# EasyEDA Pro project GroupProject2026.eprj

# Schematic Schematic1
Board Name: Board1; Create Date: 2026-05-30; Page Name: P1; Project Name: GroupProject2026; Schematic Name: Schematic1; Update Date: 2026-06-01; Company: EasyEDA.com; Page Size: A4; Version: V1.0
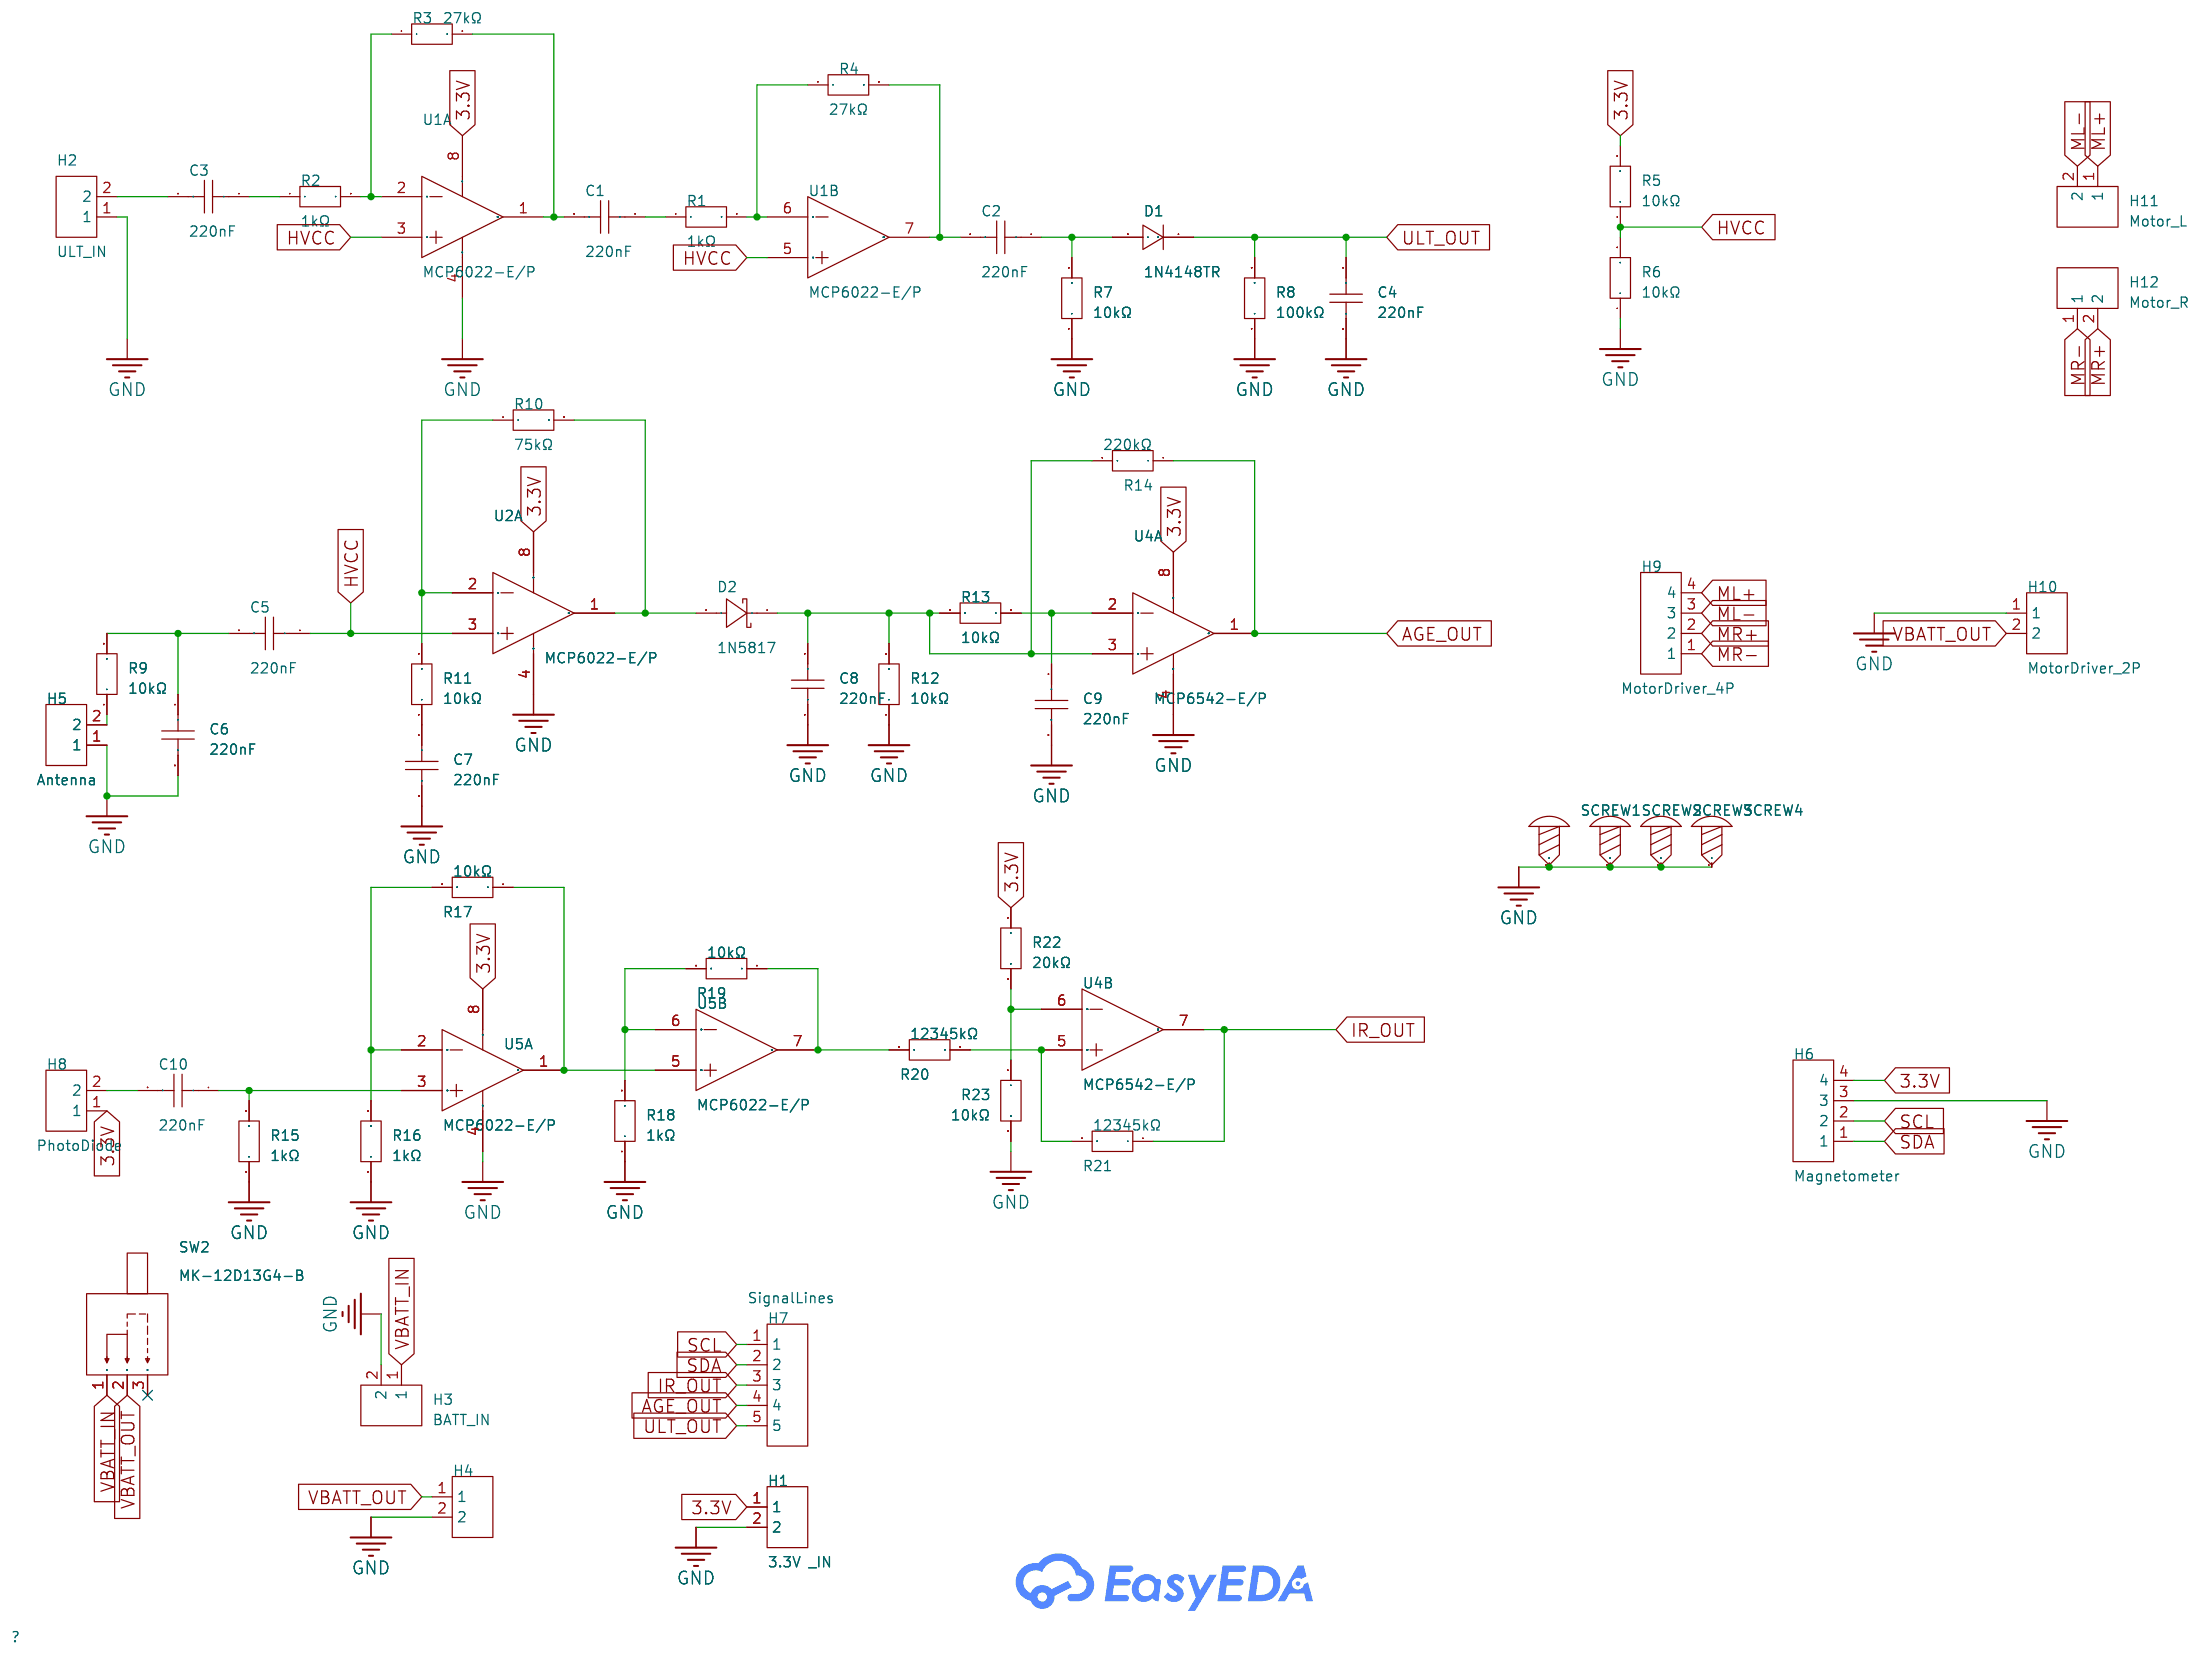
[diagram p0: schematic sheet]

## Parts
C1  220nF  [CAP-TH_L4.0-W2.5-P2.50-D0.5]
C2  220nF  [CAP-TH_L4.0-W2.5-P2.50-D0.5]
C3  220nF  [CAP-TH_L4.0-W2.5-P2.50-D0.5]
C4  220nF  [CAP-TH_L4.0-W2.5-P2.50-D0.5]
C5  220nF  [CAP-TH_L4.0-W2.5-P2.50-D0.5]
C6  220nF  [CAP-TH_L4.0-W2.5-P2.50-D0.5]
C7  220nF  [CAP-TH_L4.0-W2.5-P2.50-D0.5]
C8  220nF  [CAP-TH_L4.0-W2.5-P2.50-D0.5]
C9  220nF  [CAP-TH_L4.0-W2.5-P2.50-D0.5]
C10  220nF  [CAP-TH_L4.0-W2.5-P2.50-D0.5]
D1  1N4148TR  [DO-35_BD2.0-L4.2-P8.20-D0.5-RD]
D2  1N5817  [DO-41_BD2.4-L4.7-P8.70-D0.8-RD]
H1  3.3V _IN  [HDR-TH_2P-P2.54-V-M]
H2  ULT_IN  [HDR-TH_2P-P2.54-V-M]
H3  BATT_IN  [HDR-TH_2P-P2.54-V-M]
H4  BATT_OUT  [HDR-TH_2P-P2.54-V-M]
H5  Antenna  [HDR-TH_2P-P2.54-V-M]
H6  Magnetometer  [HDR-TH_4P-P2.54-V-M]
H7  SignalLines  [HDR-TH_5P-P2.54-V-M]
H8  PhotoDiode  [HDR-TH_2P-P2.54-V-M]
H9  MotorDriver_4P  [HDR-TH_4P-P2.54-V-M]
H10  MotorDriver_2P  [HDR-TH_2P-P2.54-V-M]
H11  Motor_L  [HDR-TH_2P-P2.54-V-M]
H12  Motor_R  [HDR-TH_2P-P2.54-V-M]
R1  1kΩ  [RES-TH_BD2.3-L6.3-P10.30-D0.6]
R2  1kΩ  [RES-TH_BD2.3-L6.3-P10.30-D0.6]
R3  27kΩ  [RES-TH_BD2.3-L6.3-P10.30-D0.6]
R4  27kΩ  [RES-TH_BD2.3-L6.3-P10.30-D0.6]
R5  10kΩ  [RES-TH_BD2.3-L6.3-P10.30-D0.6]
R6  10kΩ  [RES-TH_BD2.3-L6.3-P10.30-D0.6]
R7  10kΩ  [RES-TH_BD2.3-L6.3-P10.30-D0.6]
R8  100kΩ  [RES-TH_BD2.3-L6.3-P10.30-D0.6]
R9  10kΩ  [RES-TH_BD2.3-L6.3-P10.30-D0.6]
R10  75kΩ  [RES-TH_BD2.3-L6.3-P10.30-D0.6]
R11  10kΩ  [RES-TH_BD2.3-L6.3-P10.30-D0.6]
R12  10kΩ  [RES-TH_BD2.3-L6.3-P10.30-D0.6]
R13  10kΩ  [RES-TH_BD2.3-L6.3-P10.30-D0.6]
R14  220kΩ  [RES-TH_BD2.3-L6.3-P10.30-D0.6]
R15  1kΩ  [RES-TH_BD2.3-L6.3-P10.30-D0.6]
R16  1kΩ  [RES-TH_BD2.3-L6.3-P10.30-D0.6]
R17  10kΩ  [RES-TH_BD2.3-L6.3-P10.30-D0.6]
R18  1kΩ  [RES-TH_BD2.3-L6.3-P10.30-D0.6]
R19  10kΩ  [RES-TH_BD2.3-L6.3-P10.30-D0.6]
R20  12345kΩ  [RES-TH_BD2.3-L6.3-P10.30-D0.6]
R21  12345kΩ  [RES-TH_BD2.3-L6.3-P10.30-D0.6]
R22  20kΩ  [RES-TH_BD2.3-L6.3-P10.30-D0.6]
R23  10kΩ  [RES-TH_BD2.3-L6.3-P10.30-D0.6]
SCREW1  -  [Screw-Hole-M3]
SCREW2  -  [Screw-Hole-M3]
SCREW3  -  [Screw-Hole-M3]
SCREW4  -  [Screw-Hole-M3]
SW2  MK-12D13G4-B  [SW-TH_MK-12D13G4-B]
U1  MCP6022-E/P  [PDIP-8_L9.6-W6.4-P2.54-LS7.9-BL]  (sections 1,2)
U2  MCP6022-E/P  [PDIP-8_L9.6-W6.4-P2.54-LS7.9-BL]  (section 1)
U4  MCP6542-E/P  [PDIP-8_L9.3-W6.4-P2.54-LS7.9-BL-1]  (sections 1,2)
U5  MCP6022-E/P  [PDIP-8_L9.6-W6.4-P2.54-LS7.9-BL]  (sections 1,2)

## Library data of the parts
C1-C10 = RHEL81H224K1A2H03B: Capacitance:220nF Tolerance:±10% Tolerance:±10% Voltage Rating:50V Temperature Coefficient:X8L; LCSC Part Name: 220nF ±10% 50V; Supplier Part: C21327280; Manufacturer: muRata(村田); Supplier Footprint: 插件,P=2.5mm; Datasheet: https://item.szlcsc.com/datasheet/RHEL81H224K1A2H03B/22747908.html; Supplier: LCSC; Tolerance: ±10%; Voltage Rating: 50V; Temperature Coefficient: X8L
D1 = 1N4148TR_C84410: LCSC Part Name: 100V 200mA; Supplier Part: C84410; Manufacturer: onsemi(安森美); Supplier Footprint: DO-35; JLCPCB Part Class: Extended Part; Datasheet: https://item.szlcsc.com/datasheet/1N4148TR/85580.html; Supplier: LCSC; Diode Configuration: 1 Independent; Pd - Power Dissipation: 500mW; Current - Rectified: 200mA; Voltage - DC Reverse(Vr): 100V; Voltage - Forward(Vf@If): 1V@10mA; Non-Repetitive Peak Forward Surge Current: 4A; Reverse Leakage Current (Ir): 5uA@75V; Reverse Recovery Time (trr): 4ns; Operating Junction Temperature Range: -55℃~+175℃@(Tj)
D2 = 1N5817_C7544876: LCSC Part Name: 电压:20V 电流:1A; Supplier Part: C7544876; Manufacturer: LGE(鲁光); Supplier Footprint: DO-41; JLCPCB Part Class: Extended Part; Datasheet: https://item.szlcsc.com/datasheet/1N5817/8654312.html; Supplier: LCSC; Diode Configuration: Independent; Voltage - Forward(Vf@If): 450mV@1A; Voltage - DC Reverse(Vr): 20V; Current - Rectified: 1A; Reverse Leakage Current (Ir): 1mA@20V; Operating Junction Temperature Range: -65℃~+125℃; Non-Repetitive Peak Forward Surge Current: 30A
H1-H5 H8 H10-H12 = PZ254V-11-02P: LCSC Part Name: 1x2P 间距:2.54mm 方针 直插; Supplier Part: C492401; Manufacturer: XFCN(兴飞); Supplier Footprint: 插件,P=2.54mm; JLCPCB Part Class: Extended Part; Datasheet: https://item.szlcsc.com/datasheet/PZ254V-11-02P/502957.html; Supplier: LCSC; Pin Structure: 1x2P; Pitch: 2.54mm; Circluar Pins/Square Pins: Pin Header; Mounting Type: Through Hole; Number of Rows: 1; Number of Pins: 2P; Current Rating: 3A; Voltage Rating (Max): 250V; Length of Mating Pin: 6mm; Insulation Height: 2.5mm; Length of End Connection Pin: 3mm; Contact Material: Brass; Operating Temperature: -40℃~+105℃; Color: Black
H6 H9 = PZ2.54-S04P-A60: LCSC Part Name: 1x4P 间距:2.54mm 方针 直插; Supplier Part: C42431795; Manufacturer: JXTCONN(聚兴泰); Supplier Footprint: 插件,P=2.54mm; JLCPCB Part Class: Extended Part; Datasheet: https://item.szlcsc.com/datasheet/PZ2.54-S04P-A60/44458925.html; Supplier: LCSC; Pin Structure: 1x4P; Pitch: 2.54mm; Circluar Pins/Square Pins: Pin Header; Mounting Type: Through Hole; Number of Rows: 1; Number of Pins: 4P; Current Rating: 3A; Length of Mating Pin: 6mm; Insulation Height: 2.5mm; Length of End Connection Pin: 3mm; Contact Material: Brass; Contact Plating: Gold; Operating Temperature: -40℃~+105℃; Color: Black
H7 = 22284050: LCSC Part Name: 针座; Supplier Part: C563741; Manufacturer: MOLEX; Supplier Footprint: 插件; JLCPCB Part Class: Extended Part; Datasheet: https://www.molex.com/content/dam/molex/molex-dot-com/products/automated/en-us/salesdrawingpdf/423/42375/022284050_sd.pdf?inline\; Supplier: LCSC
R1-R23 = YR1B10KCC: LCSC Part Name: 金属膜电阻 10kΩ ±0.1% 250mW; Supplier Part: C1364313; Manufacturer: TE Connectivity(泰科电子); Supplier Footprint: 插件; JLCPCB Part Class: Extended Part; Datasheet: https://item.szlcsc.com/datasheet/YR1B10KCC/1454601.html; Supplier: LCSC; Type: Metal Film Resistor; Tolerance: ±0.1%; Power(Watts): 250mW; Temperature Coefficient: ±15ppm/℃; Operating Temperature: -65℃~+155℃
SCREW1-SCREW4 = Screw-Hole-M3: Supplier Footprint: 插件
SW2 = MK-12D13G4-B: LCSC Part Name: mini拨动开关; Supplier Part: C20611678; Manufacturer: HOOYA(皓宇电子); Supplier Footprint: 插件,P=2.5mm; JLCPCB Part Class: Extended Part; Datasheet: https://item.szlcsc.com/datasheet/MK-12D13G4-B/21966525.html; Supplier: LCSC; Circuit: SPDT; Actuator Style: Rectangular Columnar; Termination Style: PC Pin; Length: 8.5mm; Width: 3.5mm; Mounting Type: Right Angle; Current Rating: 300mA; Voltage Rating: 12V; Life: 10,000 Cycles
U1 U2 U5 = MCP6022-E/P: LCSC Part Name: 轨到轨输入/输出，10 MHz运算放大器; Supplier Part: C640398; Manufacturer: MICROCHIP(美国微芯); Supplier Footprint: PDIP-8; JLCPCB Part Class: Extended Part; Datasheet: https://item.szlcsc.com/datasheet/MCP6022-E%252FP/670195.html; Supplier: LCSC; Number of Channels: 2; Maximum Power Supply Range (Vdd-Vss): 7V; Rail to Rail: Rail-to-Rail Input, Rail-to-Rail Output; Gain Bandwidth Product: 10MHz; Vos - Input Offset Voltage: 500uV; Input Offset Voltage Drift(Vos TC): 3.5uV/℃; Slew Rate: 7V/us; Ib - Input Bias Current: 1pA; Input Offset Current(Ios): 1pA; Input Voltage Noise Density: 8.7nV/√Hz@10kHz; Common Mode Rejection Ratio(CMRR): 90dB; Quiescent Current: 1mA; Output Current: 30mA; Operating Temperature: -40℃~+125℃; Single supply: 2.5V~5.5V; Dual Supply: -8V~-1.25V；1.25V~8V; Features: Built-in compensation
U4 = MCP6542-E/P: Supplier Part: C640439; Manufacturer: MICROCHIP(美国微芯); Supplier Footprint: PDIP-8; JLCPCB Part Class: Extended Part; Datasheet: https://atta.szlcsc.com/upload/public/pdf/source/20200408/C511284_B645E46D72B56524CB56AE76B2D417C7.pdf; Supplier: LCSC; Input Offset Voltage (Vos): 7mV; Input Bias Current (Ib): 1pA; Input Hysteresis Voltage (Vhys): 6.5mV; Common Mode Rejection Ratio (CMRR): 70dB; Supply Voltage: 1.6V~5.5V; Output Type: 推挽; Output Mode: TTL；CMOS; Operating Temperature: -40℃~+125℃

## Nets
3.3V: H1.1 H6.4 H8.1 R5.2 R22.1 U1.8(VDD) U2.8(VDD) U4.8(VDD) U5.8(VDD)
GND: C4.2 C6.2 C7.2 C8.2 C9.2 H1.2 H2.1 H3.2 H4.2 H5.1 H6.3 H10.1 R6.1 R7.1 R8.1 R12.1 R15.1 R16.1 R18.1 R23.2 SCREW1.1 SCREW2.1 SCREW3.1 SCREW4.1 U1.4(VSS) U2.4(VSS) U4.4(VSS) U5.4(VSS)
VBATT_IN: H3.1 SW2.1
VBATT_OUT: H4.1 H10.2 SW2.2
AGE_OUT: H7.4 R14.1 U4.1(OUTA)
HVCC: C5.1 R5.1 R6.2 U1.3(VINA+) U1.5(VINB+) U2.3(VINA+)
IR_OUT: H7.3 R21.1 U4.7(OUTB)
ML+: H9.4 H11.1
ML-: H9.3 H11.2
MR+: H9.2 H12.2
MR-: H9.1 H12.1
SCL: H6.2 H7.1
SDA: H6.1 H7.2
ULT_OUT: C4.1 D1.1(C) H7.5 R8.2
$1N1242: C3.2 H2.2
$1N1247: C3.1 R2.1
$1N1252: R2.2 R3.1 U1.2(VINA–)
$1N1268: C1.2 R3.2 U1.1(VOUTA)
$1N1297: C1.1 R1.1
$1N1302: R1.2 R4.1 U1.6(VINB–)
$1N1324: C2.2 R4.2 U1.7(VOUTB)
$1N1575: C2.1 D1.2(A) R7.2
$1N2153: H5.2 R9.1
$1N2157: C5.2 C6.1 R9.2
$1N2539: C7.1 R11.1
$1N2543: R10.1 R11.2 U2.2(VINA–)
$1N2549: D2.2(A) R10.2 U2.1(VOUTA)
$1N2826: C8.1 D2.1(K) R12.2 R13.2 R14.2 U4.3(VINA+)
$1N2888: C9.1 R13.1 U4.2(VINA-)
$1N5513: C10.2 H8.2
$1N5517: C10.1 R15.2 U5.3(VINA+)
$1N5985: R16.2 R17.2 U5.2(VINA–)
$1N5989: R17.1 U5.1(VOUTA) U5.5(VINB+)
$1N6212: R19.1 R20.2 U5.7(VOUTB)
$1N6215: R18.2 R19.2 U5.6(VINB–)
$1N6281: R20.1 R21.2 U4.5(VINB+)
$1N6448: R22.2 R23.1 U4.6(VINB-)

Not connected (* = marked no-connect by the designer): SW2 3*

# Schematic Schematic2
Board Name: Board2; Create Date: 2026-06-01; Page Name: P1; Project Name: GroupProject2026; Schematic Name: Schematic2; Update Date: 2026-06-03; Company: EasyEDA.com; Page Size: A4; Version: V1.0
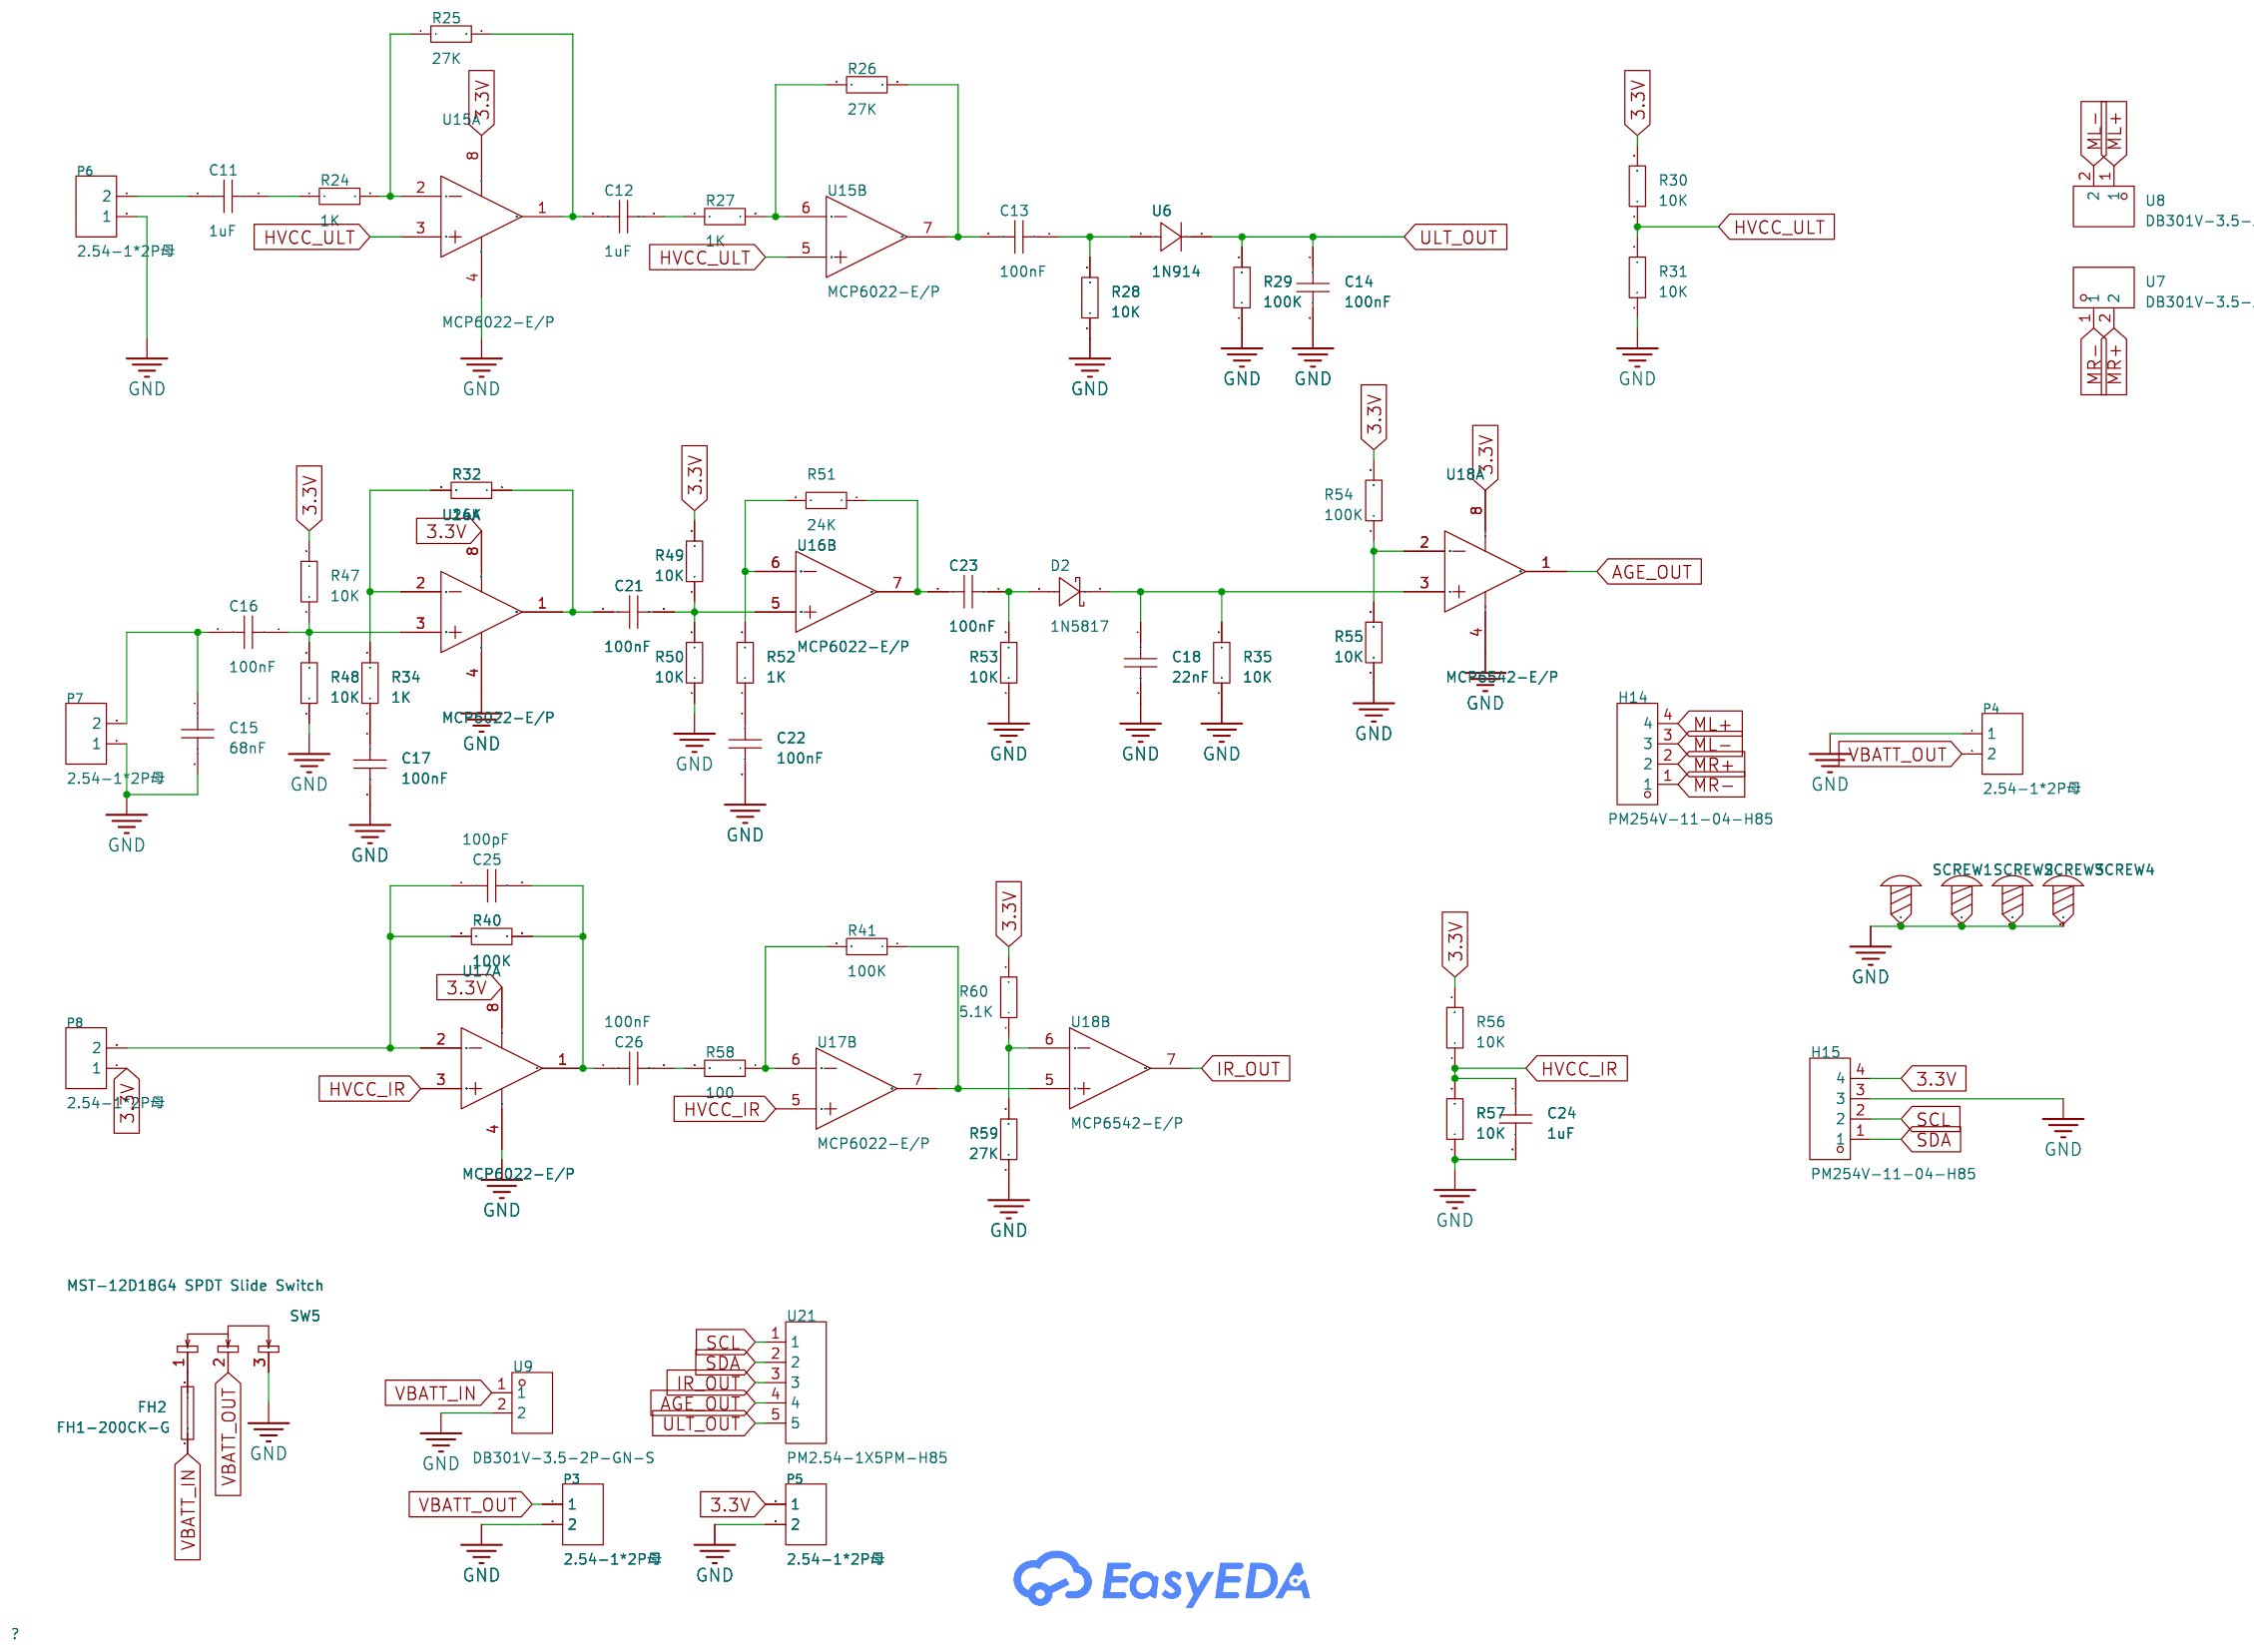
[diagram p1: schematic sheet]

## Parts
C11  1uF  [C0201]
C12  1uF  [C0201]
C13  100nF  [C0201]
C14  100nF  [C0201]
C15  68nF  [C0201]
C16  100nF  [C0201]
C17  100nF  [C0201]
C18  22nF  [C0201]
C21  100nF  [C0201]
C22  100nF  [C0201]
C23  100nF  [C0201]
C24  1uF  [C0201]
C25  100pF  [C0201]
C26  100nF  [C0201]
D2  1N5817  [DO-41_BD2.4-L4.7-P8.70-D0.8-RD]
FH2  FH1-200CK-G  [FUSE-TH_L24.8-W9.8-P22.60]
H14  PM254V-11-04-H85  [HDR-TH_4P-P2.54-V-F]
H15  PM254V-11-04-H85  [HDR-TH_4P-P2.54-V-F]
P3  2.54-1*2P母  [HDR-TH_2P-P2.54-V-F]
P4  2.54-1*2P母  [HDR-TH_2P-P2.54-V-F]
P5  2.54-1*2P母  [HDR-TH_2P-P2.54-V-F]
P6  2.54-1*2P母  [HDR-TH_2P-P2.54-V-F]
P7  2.54-1*2P母  [HDR-TH_2P-P2.54-V-F]
P8  2.54-1*2P母  [HDR-TH_2P-P2.54-V-F]
R24  1K  [R0603]
R25  27K  [R0603]
R26  27K  [R0603]
R27  1K  [R0603]
R28  10K  [R0603]
R29  100K  [R0603]
R30  10K  [R0603]
R31  10K  [R0603]
R32  24K  [R0603]
R34  1K  [R0603]
R35  10K  [R0603]
R40  100K  [R0603]
R41  100K  [R0603]
R47  10K  [R0603]
R48  10K  [R0603]
R49  10K  [R0603]
R50  10K  [R0603]
R51  24K  [R0603]
R52  1K  [R0603]
R53  10K  [R0603]
R54  100K  [R0603]
R55  10K  [R0603]
R56  10K  [R0603]
R57  10K  [R0603]
R58  100  [R0603]
R59  27K  [R0603]
R60  5.1K  [R0603]
SCREW1  -  [Screw-Hole-M3]
SCREW2  -  [Screw-Hole-M3]
SCREW3  -  [Screw-Hole-M3]
SCREW4  -  [Screw-Hole-M3]
SW5  MST-12D18G4 SPDT Slide Switch  [SW-SMD_MST-12D18G4-SPDT-SLIDE-SWITCH]
U6  1N914  [DO-35_BD2.0-L4.2-P8.20-D0.5-R-RD]
U7  DB301V-3.5-2P-GN-S  [CONN-TH_DB301V-3.5-2P-GN]
U8  DB301V-3.5-2P-GN-S  [CONN-TH_DB301V-3.5-2P-GN]
U9  DB301V-3.5-2P-GN-S  [CONN-TH_DB301V-3.5-2P-GN]
U15  MCP6022-E/P  [PDIP-8_L9.6-W6.4-P2.54-LS7.9-BL]  (sections 1,2)
U16  MCP6022-E/P  [PDIP-8_L9.6-W6.4-P2.54-LS7.9-BL]  (sections 1,2)
U17  MCP6022-E/P  [PDIP-8_L9.6-W6.4-P2.54-LS7.9-BL]  (sections 1,2)
U18  MCP6542-E/P  [PDIP-8_L9.3-W6.4-P2.54-LS7.9-BL-1]  (sections 1,2)
U21  PM2.54-1X5PM-H85  [HDR-TH_5P-P2.54-V-F-3]

## Library data of the parts
C11-C18 C21-C26 = CAP_0201: Supplier Footprint: 0201
D2 = 1N5817_C7544876: LCSC Part Name: 电压:20V 电流:1A; Supplier Part: C7544876; Manufacturer: LGE(鲁光); Supplier Footprint: DO-41; JLCPCB Part Class: Extended Part; Datasheet: https://item.szlcsc.com/datasheet/1N5817/8654312.html; Supplier: LCSC; Diode Configuration: Independent; Voltage - Forward(Vf@If): 450mV@1A; Voltage - DC Reverse(Vr): 20V; Current - Rectified: 1A; Reverse Leakage Current (Ir): 1mA@20V; Operating Junction Temperature Range: -65℃~+125℃; Non-Repetitive Peak Forward Surge Current: 30A
FH2 = FH1-200CK-G: LCSC Part Name: 两件套 保险丝夹5*20绿色（两件套）; Supplier Part: C268204; Manufacturer: HONGJU(宏聚); Supplier Footprint: 插件,P=22.6mm; JLCPCB Part Class: Extended Part; Datasheet: https://item.szlcsc.com/datasheet/FH1-200CK-G/257711.html; Supplier: LCSC
H14 H15 = PM254V-11-04-H85: LCSC Part Name: 1x4P 间距:2.54mm 直插; Supplier Part: C541851; Manufacturer: XFCN(兴飞); Supplier Footprint: 插件,P=2.54mm; JLCPCB Part Class: Extended Part; Datasheet: https://item.szlcsc.com/datasheet/PM254V-11-04-H85/562472.html; Supplier: LCSC; Holes Structure: 1x4P; Pitch: 2.54mm; Circular Hole / Square Hole: Square Hole; Mounting Type: Through Hole; Number of Rows: 1; Number of Positions: 4P; Current Rating: 3A; Holes Direction: Top; Insulation Height: 8.5mm; Contact Material: Brass; Operating Temperature: -40℃~+105℃
P3-P8 = 2.54-1*2P母: LCSC Part Name: 1x2P 间距:2.54mm 直插; Supplier Part: C49661; Manufacturer: BOOMELE(博穆精密); Supplier Footprint: 插件,P=2.54mm; JLCPCB Part Class: Extended Part; Datasheet: https://item.szlcsc.com/datasheet/2.54-1*2P%25E6%25AF%258D/50669.html; Supplier: LCSC; Holes Structure: 1x2P; Pitch: 2.54mm; Circular Hole / Square Hole: Square Hole; Mounting Type: Through Hole; Number of Rows: 1; Number of Positions: 2P; Current Rating: 3A; Holes Direction: Top; Contact Material: Brass; Operating Temperature: -40℃~+105℃; PIN Length: 3.3mm
R24-R32 R34 R35 R40 R41 R47-R60 = Res_0603: Supplier Footprint: 0603
SCREW1-SCREW4 = Screw-Hole-M3: Supplier Footprint: 插件
SW5 = MST-12D18G4 SPDT Slide Switch: LCSC Part Name: MST-12D18G4卧式带柱编带; Supplier Part: C49023767; Manufacturer: SHOU HAN(首韩); Supplier Footprint: SMD; JLCPCB Part Class: Extended Part; Datasheet: https://item.szlcsc.com/datasheet/MST-12D18G4%2520SPDT%2520Slide%2520Switch/51384142.html; Supplier: LCSC; Circuit: SPDT; Actuator Style: Rectangular Columnar; Termination Style: SMD(SMT) Tab; Length: 9.1mm; Width: 3.5mm; Switch Height: 7.5mm; Mounting Type: Surface Mount, Right Angle; Actuator Color: Black; Current Rating: 100mA; Voltage Rating: 12V; Life: 10,000 Cycles; Operating Temperature: -25℃~+70℃
U6 = 1N914_C5444762: LCSC Part Name: 75V 200mA; Supplier Part: C5444762; Manufacturer: MICROCHIP(美国微芯); Supplier Footprint: DO-35; JLCPCB Part Class: Extended Part; Datasheet: https://item.szlcsc.com/datasheet/1N914/6337368.html; Supplier: LCSC; Diode Configuration: 1 Independent; Voltage - Forward(Vf@If): 1.2V@50mA; Voltage - DC Reverse(Vr): 75V; Current - Rectified: 200mA; Reverse Leakage Current (Ir): 500nA@75V; Non-Repetitive Peak Forward Surge Current: 2A; Operating Junction Temperature Range: -65℃~+175℃
U7-U9 = DB301V-3.5-2P-GN-S: LCSC Part Name: 1x2P 3.5mm 直插 排数:1 每排P数:2; Supplier Part: C695629; Manufacturer: DORABO(地博电气); Supplier Footprint: 插件,P=3.5mm; JLCPCB Part Class: Extended Part; Datasheet: https://item.szlcsc.com/datasheet/DB301V-3.5-2P-GN-S/728965.html; Supplier: LCSC; Number of Positions or Pins: 1x2P; Pitch: 3.5mm; Color: Green; Mounting Type: Through Hole; Number of Pins: 2P; Number of Rows: 1; Number of PINs Per Row: 2; Screw Specification: M2; Current Rating: 7A; Voltage Rating (Max): 300V; Wire Gauge - AWG: 18~24; Wire Gauge - mm2: 0.5~1; Operating Temperature: -40℃~+105℃
U15-U17 = MCP6022-E/P: LCSC Part Name: 轨到轨输入/输出，10 MHz运算放大器; Supplier Part: C640398; Manufacturer: MICROCHIP(美国微芯); Supplier Footprint: PDIP-8; JLCPCB Part Class: Extended Part; Datasheet: https://item.szlcsc.com/datasheet/MCP6022-E%252FP/670195.html; Supplier: LCSC; Number of Channels: 2; Maximum Power Supply Range (Vdd-Vss): 7V; Rail to Rail: Rail-to-Rail Input, Rail-to-Rail Output; Gain Bandwidth Product: 10MHz; Vos - Input Offset Voltage: 500uV; Input Offset Voltage Drift(Vos TC): 3.5uV/℃; Slew Rate: 7V/us; Ib - Input Bias Current: 1pA; Input Offset Current(Ios): 1pA; Input Voltage Noise Density: 8.7nV/√Hz@10kHz; Common Mode Rejection Ratio(CMRR): 90dB; Quiescent Current: 1mA; Output Current: 30mA; Operating Temperature: -40℃~+125℃; Single supply: 2.5V~5.5V; Dual Supply: -8V~-1.25V；1.25V~8V; Features: Built-in compensation
U18 = MCP6542-E/P: Supplier Part: C640439; Manufacturer: MICROCHIP(美国微芯); Supplier Footprint: PDIP-8; JLCPCB Part Class: Extended Part; Datasheet: https://atta.szlcsc.com/upload/public/pdf/source/20200408/C511284_B645E46D72B56524CB56AE76B2D417C7.pdf; Supplier: LCSC; Input Offset Voltage (Vos): 7mV; Input Bias Current (Ib): 1pA; Input Hysteresis Voltage (Vhys): 6.5mV; Common Mode Rejection Ratio (CMRR): 70dB; Supply Voltage: 1.6V~5.5V; Output Type: 推挽; Output Mode: TTL；CMOS; Operating Temperature: -40℃~+125℃
U21 = PM2.54-1X5PM-H85: LCSC Part Name: 1x5P 间距:2.54mm 直插; Supplier Part: C42431843; Manufacturer: JXTCONN(聚兴泰); Supplier Footprint: 插件,P=2.54mm; JLCPCB Part Class: Extended Part; Datasheet: https://item.szlcsc.com/datasheet/PM2.54-1X5PM-H85/44458973.html; Supplier: LCSC; Holes Structure: 1x5P; Pitch: 2.54mm; Circular Hole / Square Hole: Square Hole; Mounting Type: Through Hole; Number of Rows: 1; Number of Positions: 5P; Current Rating: 3A; Holes Direction: Top; Insulation Height: 8.5mm; Contact Plating: Gold; Operating Temperature: -40℃~+105℃

## Nets
3.3V: H15.4 P5.1 P8.1 R30.2 R47.2 R49.2 R54.2 R56.2 R60.2 U15.8(VDD) U16.8(VDD) U17.8(VDD) U18.8(VDD)
GND: C14.2 C15.2 C17.2 C18.2 C22.2 C24.2 H15.3 P3.2 P4.1 P5.2 P6.1 P7.1 R28.1 R29.1 R31.1 R35.1 R48.1 R50.1 R53.1 R55.1 R57.1 R59.1 SCREW1.1 SCREW2.1 SCREW3.1 SCREW4.1 SW5.3 U9.2 U15.4(VSS) U16.4(VSS) U17.4(VSS) U18.4(VSS)
VBATT_IN: FH2.1 U9.1
VBATT_OUT: P3.1 P4.2 SW5.2
AGE_OUT: U18.1(OUTA) U21.4
HVCC_IR: C24.1 R56.1 R57.2 U17.3(VINA+) U17.5(VINB+)
HVCC_ULT: R30.1 R31.2 U15.3(VINA+) U15.5(VINB+)
IR_OUT: U18.7(OUTB) U21.3
ML+: H14.4 U8.1
ML-: H14.3 U8.2
MR+: H14.2 U7.2
MR-: H14.1 U7.1
SCL: H15.2 U21.1
SDA: H15.1 U21.2
ULT_OUT: C14.1 R29.2 U6.2(K) U21.5
$1N2978: C11.2 P6.2
$1N2979: C11.1 R24.1
$1N2980: R24.2 R25.1 U15.2(VINA–)
$1N2981: C12.2 R25.2 U15.1(VOUTA)
$1N2983: C12.1 R27.1
$1N2984: R26.1 R27.2 U15.6(VINB–)
$1N2986: C13.2 R26.2 U15.7(VOUTB)
$1N2990: C13.1 R28.2 U6.1(A)
$1N2997: C15.1 C16.2 P7.2
$1N2999: C16.1 R47.1 R48.2 U16.3(VINA+)
$1N3003: R32.2 R34.2 U16.2(VINA–)
$1N3004: C21.1 R32.1 U16.1(VOUTA)
$1N3031: C25.1 P8.2 R40.2 U17.2(VINA–)
$1N3032: C25.2 C26.1 R40.1 U17.1(VOUTA)
$1N3034: R41.1 U17.7(VOUTB) U18.5(VINB+)
$1N4237: C17.1 R34.1
$1N8727: C18.1 D2.1(K) R35.2 U18.3(VINA+)
$1N9006: C21.2 R49.1 R50.2 U16.5(VINB+)
$1N9117: C23.2 R51.1 U16.7(VOUTB)
$1N9118: R51.2 R52.2 U16.6(VINB–)
$1N9122: C22.1 R52.1
$1N9252: C23.1 D2.2(A) R53.2
$1N9334: R54.1 R55.2 U18.2(VINA-)
$1N11674: C26.2 R58.2
$1N11682: R41.2 R58.1 U17.6(VINB–)
$1N11954: R59.2 R60.1 U18.6(VINB-)
$1N13885: FH2.2 SW5.1

# Board PCB1
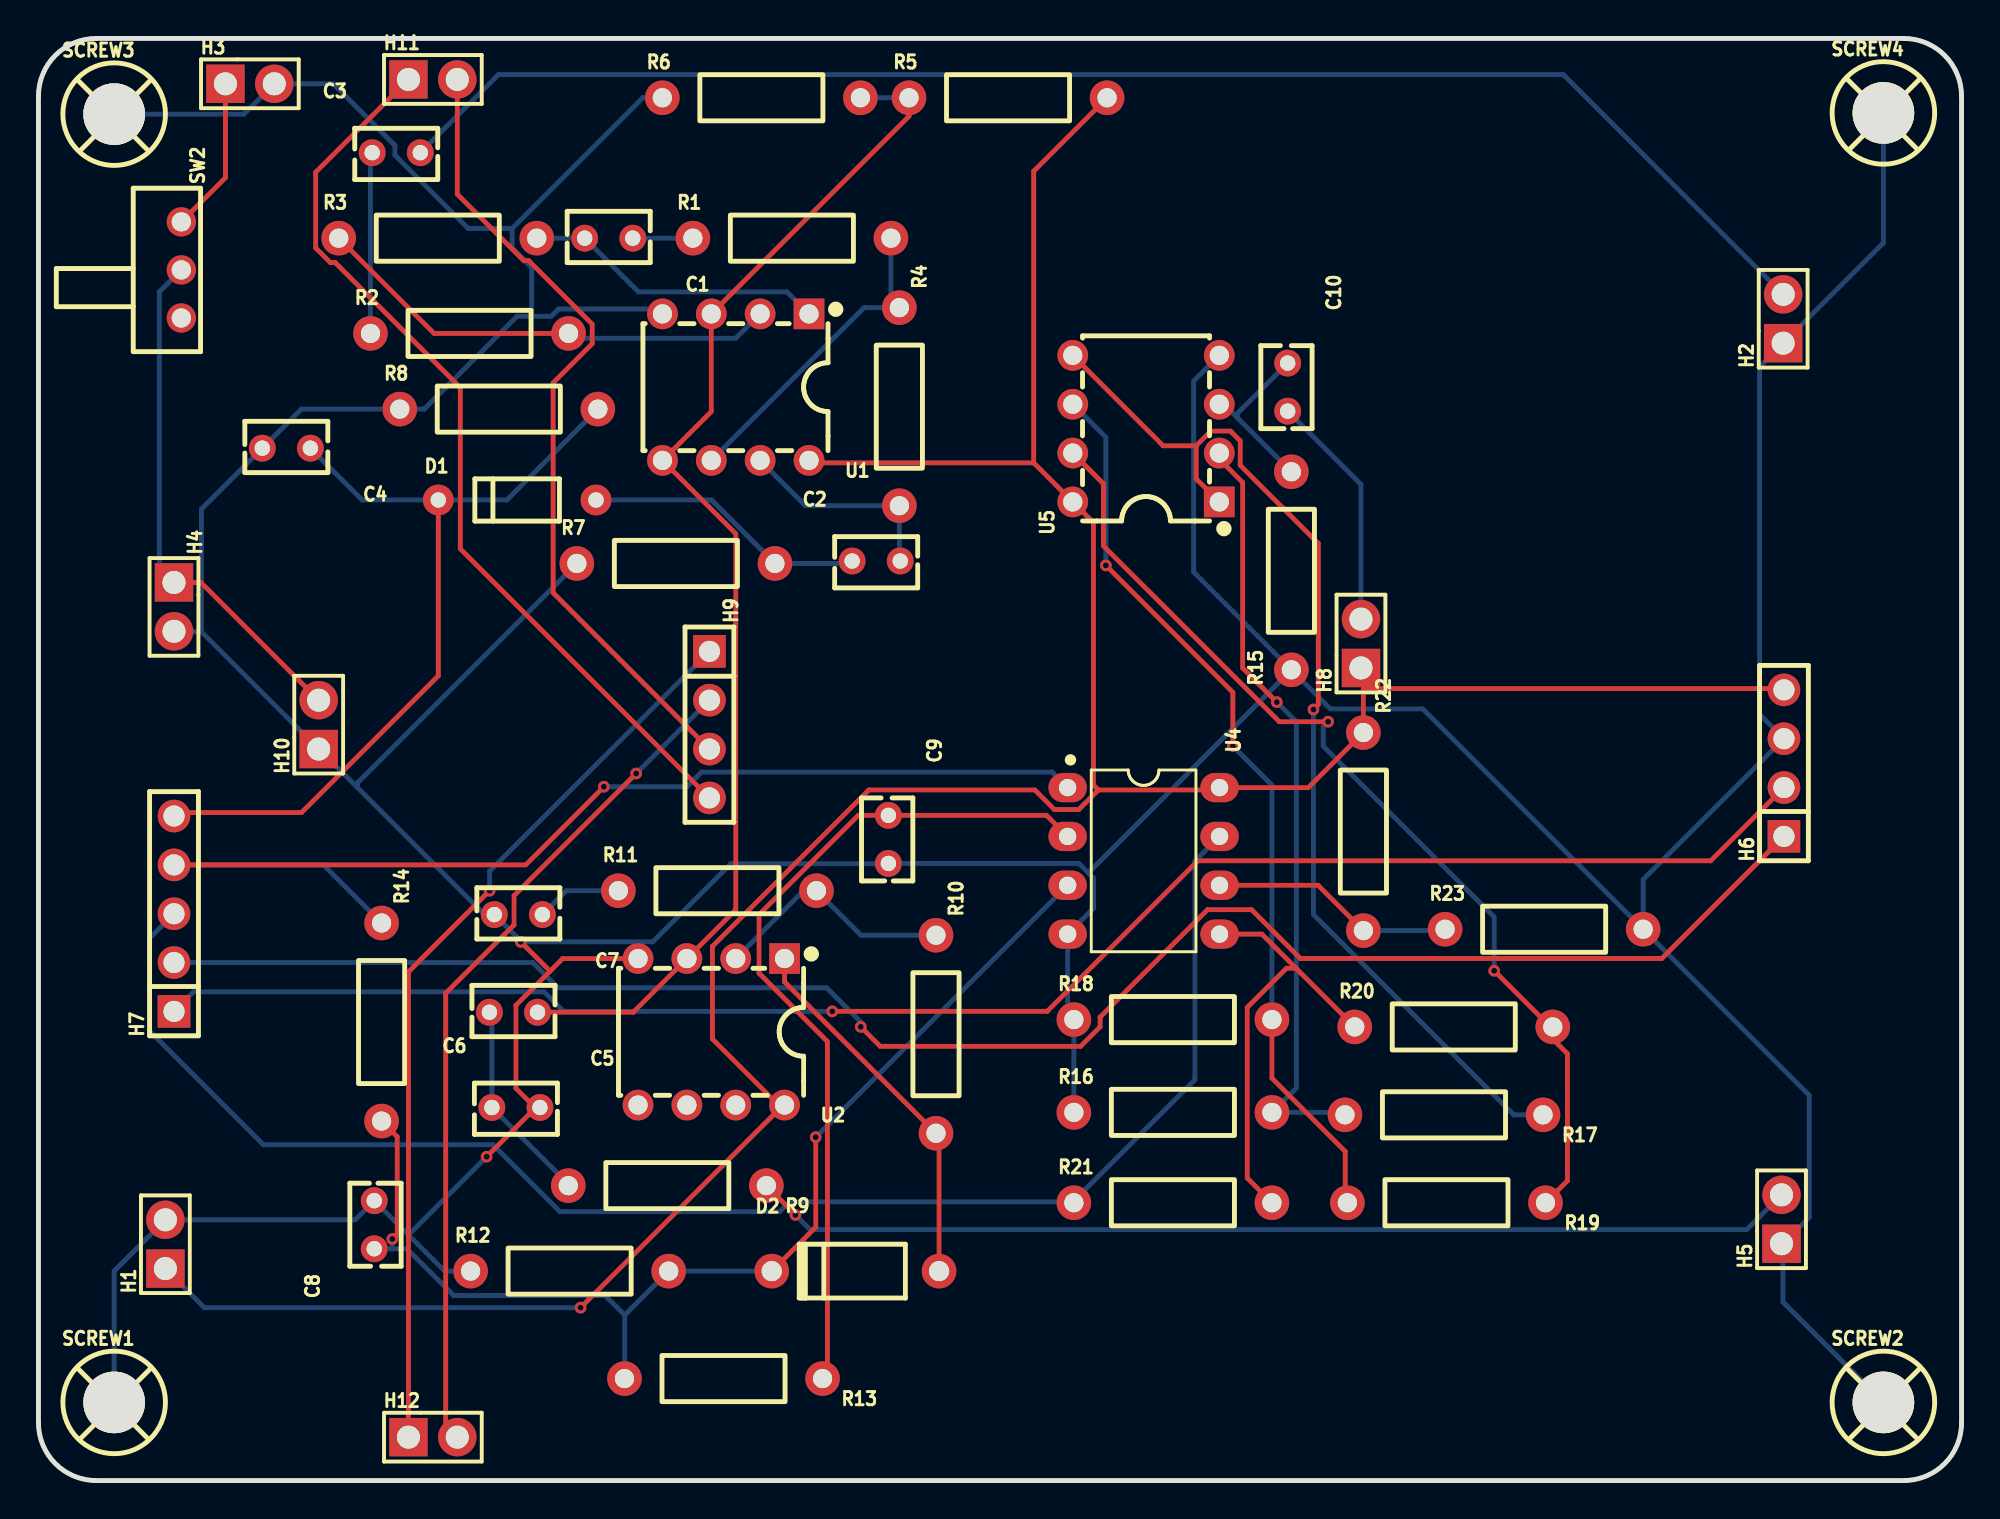
[diagram p2: board, top side]
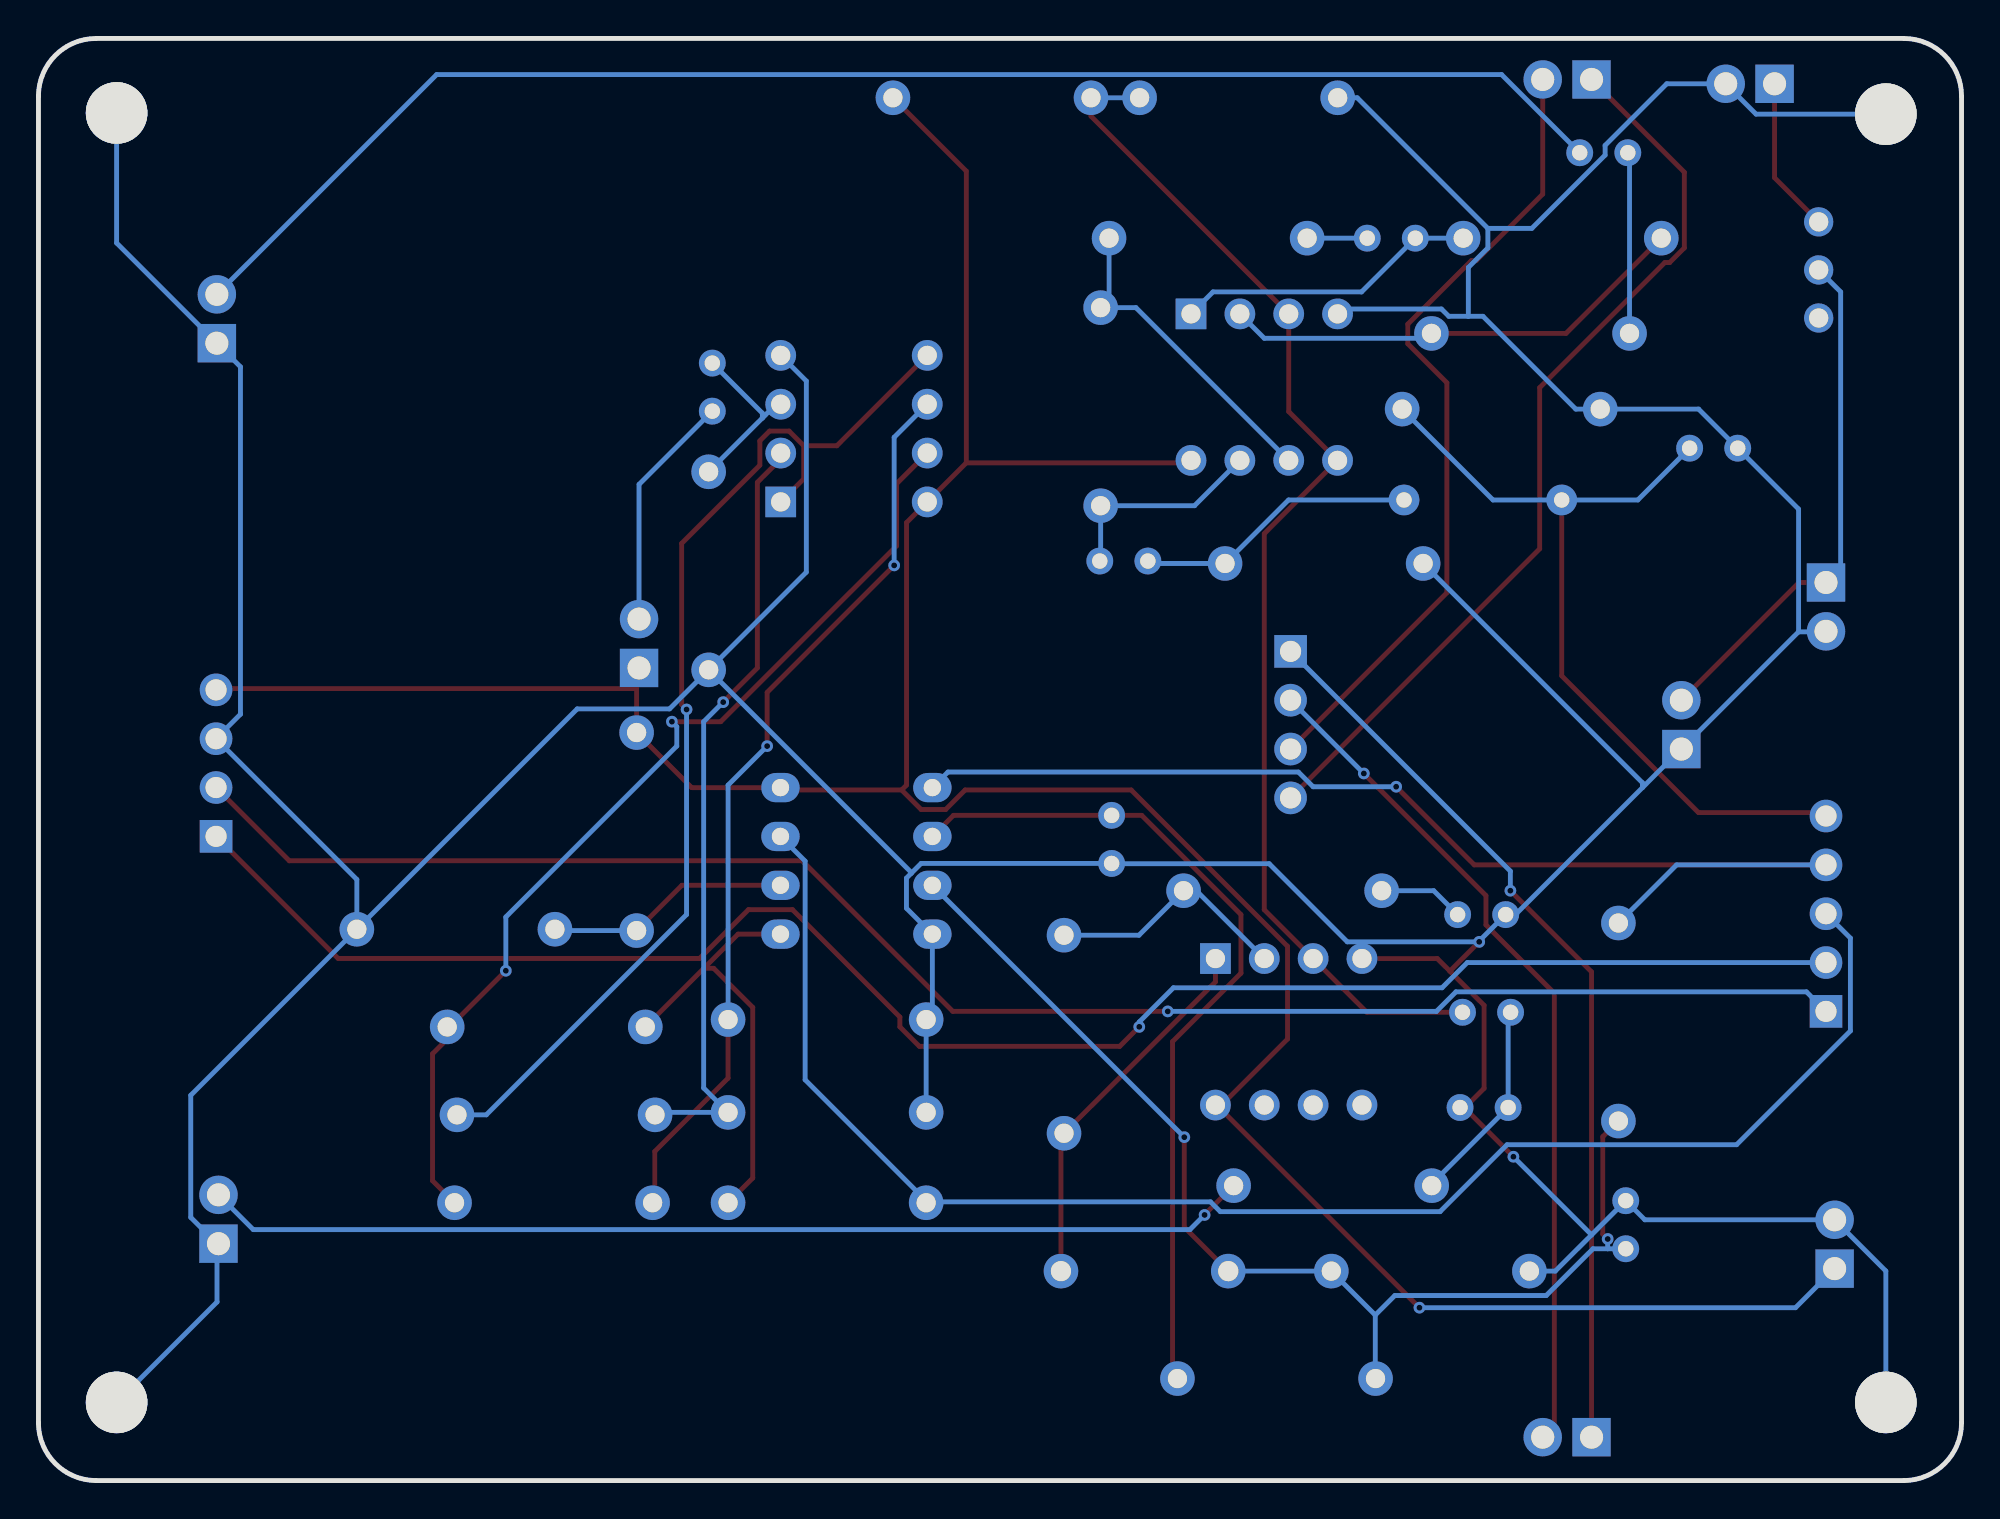
[diagram p3: board, bottom side, seen from below]

Outline 100 x 75 mm; copper layers: Top Layer, Bottom Layer. Coordinates in mm from the lower left corner of the outline.
Outline path: 0,72 0,3 arc(0.88,0.88) 3,0 97,0 arc(99.12,0.88) 100,3 100,72 arc(99.12,74.12) 97,75 3,75 arc(0.88,74.12) 0,72
Stack: Top Layer 0.035mm / Dielectric1 1.51mm FR4 er 4.5 / Bottom Layer 0.035mm

## Design rules (mm)
template: JLCPCB Capability(Two Layers Board)
spacing copperThickness1oz (default): track to track 0.102, other pairs 0.152 to 0.3
spacing copperThickness2oz: track to track 0.203, other pairs 0.152 to 0.3
track width copperThickness1oz (default): min 0.127, default 0.254, max 2.54
track width copperThickness2oz: min 0.203, default 0.254, max 2.54
differential pair differentialPair (default): width min 0.127, default 0.254, max 2.54; gap min 0.152, default 0.152
via viaSize (default): diameter min 0.5, default 0.61, max 10; hole min 0.3, default 0.305, max 6.3

## Placement (name value [footprint] x y rotation side)
C1  220nF  [CAP-TH_L4.0-W2.5-P2.50-D0.5]  29.65 64.61 180 top
C2  220nF  [CAP-TH_L4.0-W2.5-P2.50-D0.5]  43.56 47.82 0 top
C3  220nF  [CAP-TH_L4.0-W2.5-P2.50-D0.5]  18.6 69.06 0 top
C4  220nF  [CAP-TH_L4.0-W2.5-P2.50-D0.5]  12.89 53.69 180 top
C5  220nF  [CAP-TH_L4.0-W2.5-P2.50-D0.5]  24.7 24.35 180 top
C6  220nF  [CAP-TH_L4.0-W2.5-P2.50-D0.5]  24.83 19.4 0 top
C7  220nF  [CAP-TH_L4.0-W2.5-P2.50-D0.5]  24.95 29.43 180 top
C8  220nF  [CAP-TH_L4.0-W2.5-P2.50-D0.5]  17.46 13.31 90 top
C9  220nF  [CAP-TH_L4.0-W2.5-P2.50-D0.5]  44.2 33.34 270 top
C10  220nF  [CAP-TH_L4.0-W2.5-P2.50-D0.5]  64.96 56.87 270 top
D1  1N4148TR  [DO-35_BD2.0-L4.2-P8.20-D0.5-RD]  24.89 51 0 top
D2  1N5817  [DO-41_BD2.4-L4.7-P8.70-D0.8-RD]  42.48 10.89 0 top
H1  3.3V _IN  [HDR-TH_2P-P2.54-V-M]  6.6 12.29 90 top
H2  ULT_IN  [HDR-TH_2P-P2.54-V-M]  90.72 60.42 90 top
H3  BATT_IN  [HDR-TH_2P-P2.54-V-M]  10.99 72.64 0 top
H4  BATT_OUT  [HDR-TH_2P-P2.54-V-M]  7.05 45.44 270 top
H5  Antenna  [HDR-TH_2P-P2.54-V-M]  90.64 13.59 90 top
H6  Magnetometer  [HDR-TH_4P-P2.54-V-M]  90.77 37.31 90 top
H7  SignalLines  [HDR-TH_5P-P2.54-V-M]  7.05 29.48 90 top
H8  PhotoDiode  [HDR-TH_2P-P2.54-V-M]  68.77 43.53 90 top
H9  MotorDriver_4P  [HDR-TH_4P-P2.54-V-M]  34.89 39.31 270 top
H10  MotorDriver_2P  [HDR-TH_2P-P2.54-V-M]  14.57 39.31 90 top
H11  Motor_L  [HDR-TH_2P-P2.54-V-M]  20.51 72.87 0 top
H12  Motor_R  [HDR-TH_2P-P2.54-V-M]  20.51 2.26 0 top
R1  1kΩ  [RES-TH_BD2.3-L6.3-P10.30-D0.6]  39.18 64.61 0 top
R2  1kΩ  [RES-TH_BD2.3-L6.3-P10.30-D0.6]  22.41 59.66 0 top
R3  27kΩ  [RES-TH_BD2.3-L6.3-P10.30-D0.6]  20.76 64.61 0 top
R4  27kΩ  [RES-TH_BD2.3-L6.3-P10.30-D0.6]  44.77 55.85 270 top
R5  10kΩ  [RES-TH_BD2.3-L6.3-P10.30-D0.6]  50.42 71.92 0 top
R6  10kΩ  [RES-TH_BD2.3-L6.3-P10.30-D0.6]  37.59 71.92 0 top
R7  10kΩ  [RES-TH_BD2.3-L6.3-P10.30-D0.6]  33.15 47.69 0 top
R8  100kΩ  [RES-TH_BD2.3-L6.3-P10.30-D0.6]  23.94 55.72 0 top
R9  10kΩ  [RES-TH_BD2.3-L6.3-P10.30-D0.6]  32.7 15.34 180 top
R10  75kΩ  [RES-TH_BD2.3-L6.3-P10.30-D0.6]  46.67 23.21 270 top
R11  10kΩ  [RES-TH_BD2.3-L6.3-P10.30-D0.6]  35.31 30.68 0 top
R12  10kΩ  [RES-TH_BD2.3-L6.3-P10.30-D0.6]  27.62 10.89 0 top
R13  10kΩ  [RES-TH_BD2.3-L6.3-P10.30-D0.6]  35.62 5.3 180 top
R14  220kΩ  [RES-TH_BD2.3-L6.3-P10.30-D0.6]  17.84 23.85 270 top
R15  1kΩ  [RES-TH_BD2.3-L6.3-P10.30-D0.6]  65.15 47.31 90 top
R16  1kΩ  [RES-TH_BD2.3-L6.3-P10.30-D0.6]  58.99 19.15 0 top
R17  10kΩ  [RES-TH_BD2.3-L6.3-P10.30-D0.6]  73.09 19.02 180 top
R18  1kΩ  [RES-TH_BD2.3-L6.3-P10.30-D0.6]  58.99 23.97 0 top
R19  10kΩ  [RES-TH_BD2.3-L6.3-P10.30-D0.6]  73.21 14.45 180 top
R20  12345kΩ  [RES-TH_BD2.3-L6.3-P10.30-D0.6]  73.6 23.59 0 top
R21  12345kΩ  [RES-TH_BD2.3-L6.3-P10.30-D0.6]  58.99 14.45 0 top
R22  20kΩ  [RES-TH_BD2.3-L6.3-P10.30-D0.6]  68.9 33.75 270 top
R23  10kΩ  [RES-TH_BD2.3-L6.3-P10.30-D0.6]  78.29 28.67 0 top
SCREW1  -  [Screw-Hole-M3]  4 4 0 top
SCREW2  -  [Screw-Hole-M3]  96 4 0 top
SCREW3  -  [Screw-Hole-M3]  4 71 0 top
SCREW4  -  [Screw-Hole-M3]  96 71.06 0 top
SW2  MK-12D13G4-B  [SW-TH_MK-12D13G4-B]  7.43 62.96 270 top
U1  MCP6022-E/P  [PDIP-8_L9.6-W6.4-P2.54-LS7.9-BL]  36.26 56.87 180 top
U2  MCP6022-E/P  [PDIP-8_L9.6-W6.4-P2.54-LS7.9-BL]  34.99 23.34 180 top
U4  MCP6542-E/P  [PDIP-8_L9.3-W6.4-P2.54-LS7.9-BL-1]  57.47 32.23 270 top
U5  MCP6022-E/P  [PDIP-8_L9.6-W6.4-P2.54-LS7.9-BL]  57.59 54.71 90 top

## Footprints (pads in the part's own frame, mm; a bottom-side part is the same pattern mirrored in y, then rotated)
CAP-TH_L4.0-W2.5-P2.50-D0.5
  round 1.4 hole 0.8: 1(-1.25,0) 2(1.25,0)
DO-35_BD2.0-L4.2-P8.20-D0.5-RD
  round 1.6 hole 0.8: 1(-4.1,0) 2(4.1,0)
DO-41_BD2.4-L4.7-P8.70-D0.8-RD
  round 1.8 hole 1.05: 1(-4.35,0) 2(4.35,0)
HDR-TH_2P-P2.54-V-M
  rect 2x2 hole 1.2: 1(-1.27,0)
  round 2 hole 1.2: 2(1.27,0)
HDR-TH_4P-P2.54-V-M
  rect 1.7x1.7 hole 1.1: 1(-3.81,0)
  round 1.7 hole 1.1: 2(-1.27,0) 3(1.27,0) 4(3.81,0)
HDR-TH_5P-P2.54-V-M
  rect 1.7x1.7 hole 1.1: 1(-5.08,0)
  round 1.7 hole 1.1: 2(-2.54,0) 3(0,0) 4(2.54,0) 5(5.08,0)
PDIP-8_L9.3-W6.4-P2.54-LS7.9-BL-1
  oval 1.524x2 hole 0.9: 1(-3.81,-3.95) 2(-1.27,-3.95) 3(1.27,-3.95) 4(3.81,-3.95) 5(3.81,3.95) 6(1.27,3.95) 7(-1.27,3.95) 8(-3.81,3.95)
PDIP-8_L9.6-W6.4-P2.54-LS7.9-BL
  rect 1.6x1.6 hole 1: 1(-3.81,-3.81)
  round 1.6 hole 1: 2(-1.27,-3.81) 3(1.27,-3.81) 4(3.81,-3.81) 5(3.81,3.81) 6(1.27,3.81) 7(-1.27,3.81) 8(-3.81,3.81)
RES-TH_BD2.3-L6.3-P10.30-D0.6
  round 1.8 hole 1: 1(-5.15,0) 2(5.15,0)
Screw-Hole-M3
  round 3.2 hole 3.2: 1(-0.064,0.064)
SW-TH_MK-12D13G4-B
  round 1.524 hole 1: 1(-2.5,0) 2(0,0) 3(2.5,0)

## Nets
As in the schematic.

Pads without a net: SW2 3; U2 5 6 7

## Via types
v1: diameter 0.61, hole 0.305, Top Layer to Bottom Layer, 17 vias

## Routing (per net, layer and track width the routed paths; a pad name or vN(x,y) marks a point on that pad's centre or on a via; arc(x,y) is an arc through that point)
3.3V: length 162.6
  Top Layer w0.254: 68.9,41.19 68.9,42.13 68.77,42.26 ; 68.9,41.19 R22.1 66.03,36.04 U4.8 61.29,35.91 55.11,35.91 ; 68.9,41.19 90.7,41.19 H6.4 ; 51.75,52.93 U5.8 54.86,49.82 54.86,36.17 55.11,35.91 ; 51.75,52.93 40.19,52.93 U1.8 ; 51.75,52.93 51.75,68.1 R5.2 ; 38.6,19.4 35.05,22.96 35.05,27.79 43.18,35.91 51.81,35.91 52.83,34.9 54.1,34.9 55.11,35.91 ; 38.6,19.4 U2.8 ; 38.6,19.4 v1(28.19,8.99)
  Bottom Layer w0.254: H1.1 8.63,8.99 v1(28.19,8.99)
GND: length 351.7
  Top Layer w0.254: 26.61,26.49 24.83,24.71 24.83,20.4 25.84,19.38 ; 26.61,26.49 27.26,27.15 U2.4 ; 26.61,26.49 v1(25.08,28.02) ; 25.84,19.38 C6.2 ; 25.84,19.38 v1(23.3,16.84)
  Bottom Layer w0.254: 24.63,65.12 24.63,64.11 25.65,63.09 25.65,60.55 ; 24.63,65.12 22.34,65.12 18.53,68.93 18.53,69.44 15.33,72.64 12.26,72.64 10.68,71.06 SCREW3.1 ; 24.63,65.12 31.43,71.92 R6.1 ; 54.61,31.59 54.1,32.09 C9.2 44.18,32.08 36,32.08 31.94,28.02 v1(25.08,28.02) 25.08,28.06 C7.2 23.2,29.43 16.59,36.04 ; 54.61,31.59 54.86,31.33 54.86,29.77 U4.4 53.52,24.3 R18.1 R16.1 ; 54.61,31.59 54.61,31.62 R15.1 ; H4.2 7.07,44.14 8.47,44.14 ; U5.4 60.07,57.18 60.07,47.24 R15.1 ; U1.4 32.19,60.93 27.04,60.93 26.66,60.55 25.65,60.55 ; 90.71,12.32 H5.1 ; 90.71,12.32 90.71,9.29 SCREW2.1 ; 90.71,12.32 92.08,13.69 92.08,20.04 R23.2 ; 25.65,60.55 24.88,60.55 20.06,55.72 R8.1 13.67,55.72 C4.2 8.47,50.53 8.47,44.14 ; R12.1 21.12,10.89 19.24,12.78 ; SCREW4.1 95.94,64.36 H2.1 89.5,57.92 89.5,39.85 H6.3 83.44,31.26 R23.2 ; R15.1 67.18,40.13 71.98,40.13 R23.2 ; 19.24,12.78 v1(23.3,16.84) ; 19.24,12.78 17.46,14.55 16.47,13.56 H1.2 3.94,10.9 SCREW1.1 ; R7.1 16.59,36.29 16.59,36.04 ; 8.47,44.14 H10.1 14.59,38.04 16.59,36.04
VBATT_IN: length 8.1
  Top Layer w0.254: SW2.1 9.72,67.76 H3.1
VBATT_OUT: length 27.1
  Top Layer w0.254: H4.1 8.45,46.71 H10.2
  Bottom Layer w0.254: SW2.2 6.29,61.82 6.29,47.47 H4.1
AGE_OUT: length 60.8
  Top Layer w0.254: H7.4 25.34,32.02 v1(29.4,36.08)
  Bottom Layer w0.254: U4.1 52.71,36.85 34.48,36.85 33.72,36.08 v1(29.4,36.08) ; H7.4 14.82,32.02 R14.1
HVCC: length 64.2
  Top Layer w0.254: R5.1 45.27,70.96 U1.3 34.99,55.6 U1.5 36.26,49.25 36.26,29.69 U2.3 30.92,24.35 C5.1
  Bottom Layer w0.254: R5.1 R6.2
IR_OUT: length 81
  Bottom Layer w0.254: 53.78,14.49 R21.1 ; 53.78,14.49 39.05,14.49 38.54,13.99 27.11,13.99 23.63,17.47 11.7,17.47 5.78,23.38 5.78,28.21 H7.3 ; 53.78,14.49 60.13,20.84 60.13,32.22 U4.7
ML+: length 48
  Top Layer w0.254: H9.4 21.94,48.46 21.94,56.84 15.43,63.35 15.18,63.35 14.41,64.11 14.41,68.04 H11.1
ML-: length 42.1
  Top Layer w0.254: H9.3 26.76,46.17 26.76,57.09 28.79,59.12 28.79,60.14 25.49,63.44 25.24,63.44 21.78,66.9 H11.2
MR+: length 44.3
  Top Layer w0.254: H12.2 21.17,2.86 21.17,25.34 24.73,28.9 24.73,30.42 v1(31.08,36.77)
  Bottom Layer w0.254: H9.2 v1(31.08,36.77)
MR-: length 47.3
  Top Layer w0.254: v1(23.46,30.68) 19.24,26.46 H12.1
  Bottom Layer w0.254: v1(23.46,30.68) 23.46,31.69 H9.1
SCL: length 89.4
  Top Layer w0.254: H6.2 86.96,32.23 60.29,32.23 52.45,24.4 v1(41.28,24.4)
  Bottom Layer w0.254: v1(41.28,24.4) 27.31,24.4 26.29,25.42 8.06,25.42 H7.1
SDA: length 92.6
  Top Layer w0.254: H6.1 84.42,27.15 65.62,27.15 63.08,29.69 60.79,29.69 55.21,24.1 55.21,23.6 54.19,22.58 43.78,22.58 v1(42.76,23.6)
  Bottom Layer w0.254: H7.2 25.7,26.94 27.01,25.63 40.98,25.63 42.76,23.85 v1(42.76,23.6)
ULT_OUT: length 43.9
  Top Layer w0.254: D1.1 20.79,41.85 13.68,34.74 7.23,34.74 H7.5
  Bottom Layer w0.254: C4.1 16.83,51 D1.1 24.36,51 R8.2
$1N1242: length 77.3
  Bottom Layer w0.254: H2.2 79.29,73.12 23.92,73.12 C3.2
$1N1247: length 9.4
  Bottom Layer w0.254: R2.1 17.26,68.97 C3.1
$1N1252: length 24.6
  Top Layer w0.254: R3.1 20.57,59.66 R2.2
  Bottom Layer w0.254: U1.2 36.26,59.41 27.82,59.41 R2.2
$1N1268: length 15.8
  Bottom Layer w0.254: R3.2 C1.2 31.2,61.82 38.92,61.82 U1.1
$1N1297: length 3.1
  Bottom Layer w0.254: R1.1 C1.1
$1N1302: length 16.9
  Bottom Layer w0.254: R1.2 44.33,61.44 R4.1 42.93,61 U1.6
$1N1324: length 11.1
  Bottom Layer w0.254: C2.2 44.77,47.87 R4.2 39.88,50.7 U1.7
$1N1575: length 14.7
  Bottom Layer w0.254: C2.1 42.18,47.69 R7.2 35,51 D1.2
$1N2153: length 54.5
  Top Layer w0.254: R9.1 39.36,13.83 v1(39.36,13.81)
  Bottom Layer w0.254: H5.2 88.83,13.05 40.12,13.05 v1(39.36,13.81)
$1N2157: length 10.7
  Bottom Layer w0.254: C5.2 23.58,24.23 C6.1 27.55,15.43 R9.2
$1N2539: length 4.5
  Bottom Layer w0.254: R11.1 27.45,30.68 C7.1
$1N2543: length 12.8
  Bottom Layer w0.254: R10.1 42.77,28.36 R11.2 39.79,30.68 U2.2
$1N2549: length 19.6
  Top Layer w0.254: U2.1 38.8,25.94 R10.2 46.83,17.9 D2.2
$1N2826: length 59.9
  Top Layer w0.254: R14.2 18.65,17.88 18.65,12.82 v1(18.4,12.56) ; D2.1 40.42,13.18 v1(40.42,17.86)
  Bottom Layer w0.254: R13.2 30.49,5.32 30.49,8.61 ; 30.49,8.61 29.47,9.62 21.6,9.62 19.16,12.06 18.4,12.06 ; 30.49,8.61 R12.2 D2.1 ; 18.4,12.06 v1(18.4,12.56) ; 18.4,12.06 C8.1 ; v1(40.42,17.86) U4.3
$1N2888: length 44.3
  Top Layer w0.254: U4.2 52.42,34.59 C9.1 42.63,34.59 37.47,29.43 37.47,26.39 41.03,22.83 41.03,5.56 R13.1
$1N5513: length 12.4
  Bottom Layer w0.254: C10.2 68.77,51.81 H8.2
$1N5517: length 9.1
  Bottom Layer w0.254: R15.2 62.36,55.26 ; 62.36,55.26 62.36,55.51 C10.1 ; 62.36,55.26 61.64,55.98 U5.3
$1N5985: length 40.3
  Top Layer w0.254: v1(64.39,40.48) 62.62,42.26 62.62,51.91 61.4,53.13 U5.2
  Bottom Layer w0.254: R17.2 67.81,19.15 R16.2 65.41,20.42 65.41,39.47 v1(64.39,40.48)
$1N5989: length 57.3
  Top Layer w0.254: 60.2,53.82 60.2,52.1 U5.1 ; 60.2,53.82 58.48,53.82 U5.5 ; 60.2,53.82 60.97,54.58 61.98,54.58 62.49,54.07 62.49,52.8 66.55,48.74 66.55,40.36 v1(66.3,40.1)
  Bottom Layer w0.254: v1(66.3,40.1) 66.3,29.43 76.71,19.02 R17.1
$1N6212: length 51.9
  Top Layer w0.254: R19.1 79.51,15.59 79.51,22.19 78.75,22.96 78.75,23.47 ; v1(67.06,39.47) 64.52,39.47 55.38,48.61 55.38,51.84 U5.7 ; 78.75,23.47 R20.2 ; 78.75,23.47 v1(75.7,26.51)
  Bottom Layer w0.254: v1(75.7,26.51) 75.7,29.31 66.81,38.2 66.81,39.21 v1(67.06,39.47)
$1N6215: length 47.4
  Top Layer w0.254: v1(62.11,38.2) 62.11,40.99 v1(55.5,47.59) ; R18.2 64.14,20.92 67.95,17.11 67.95,14.56 R19.2
  Bottom Layer w0.254: R18.2 64.14,36.17 v1(62.11,38.2) ; v1(55.5,47.59) 55.5,54.26 U5.6
$1N6281: length 23.1
  Top Layer w0.254: 65.4,26.64 64.89,26.64 62.86,24.61 62.86,15.73 R21.2 ; 65.4,26.64 63.62,28.42 U4.5 ; 65.4,26.64 R20.1
$1N6448: length 12.7
  Top Layer w0.254: R22.2 66.54,30.96 U4.6
  Bottom Layer w0.254: R23.1 73.07,28.6 R22.2

# Board PCB2
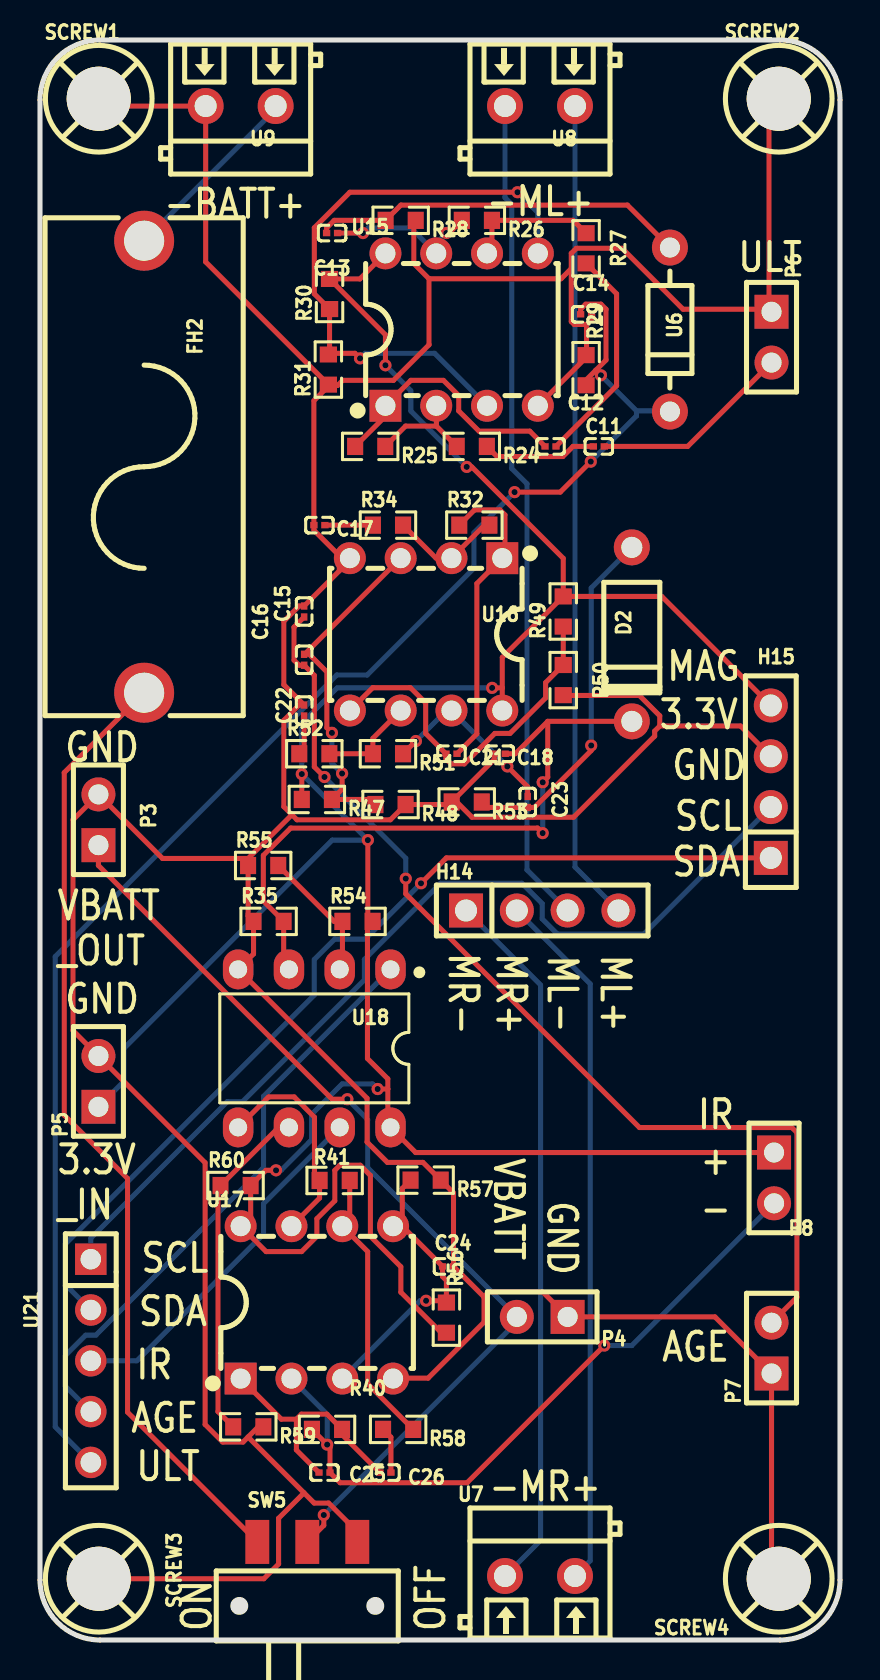
[diagram p4: board, top side]
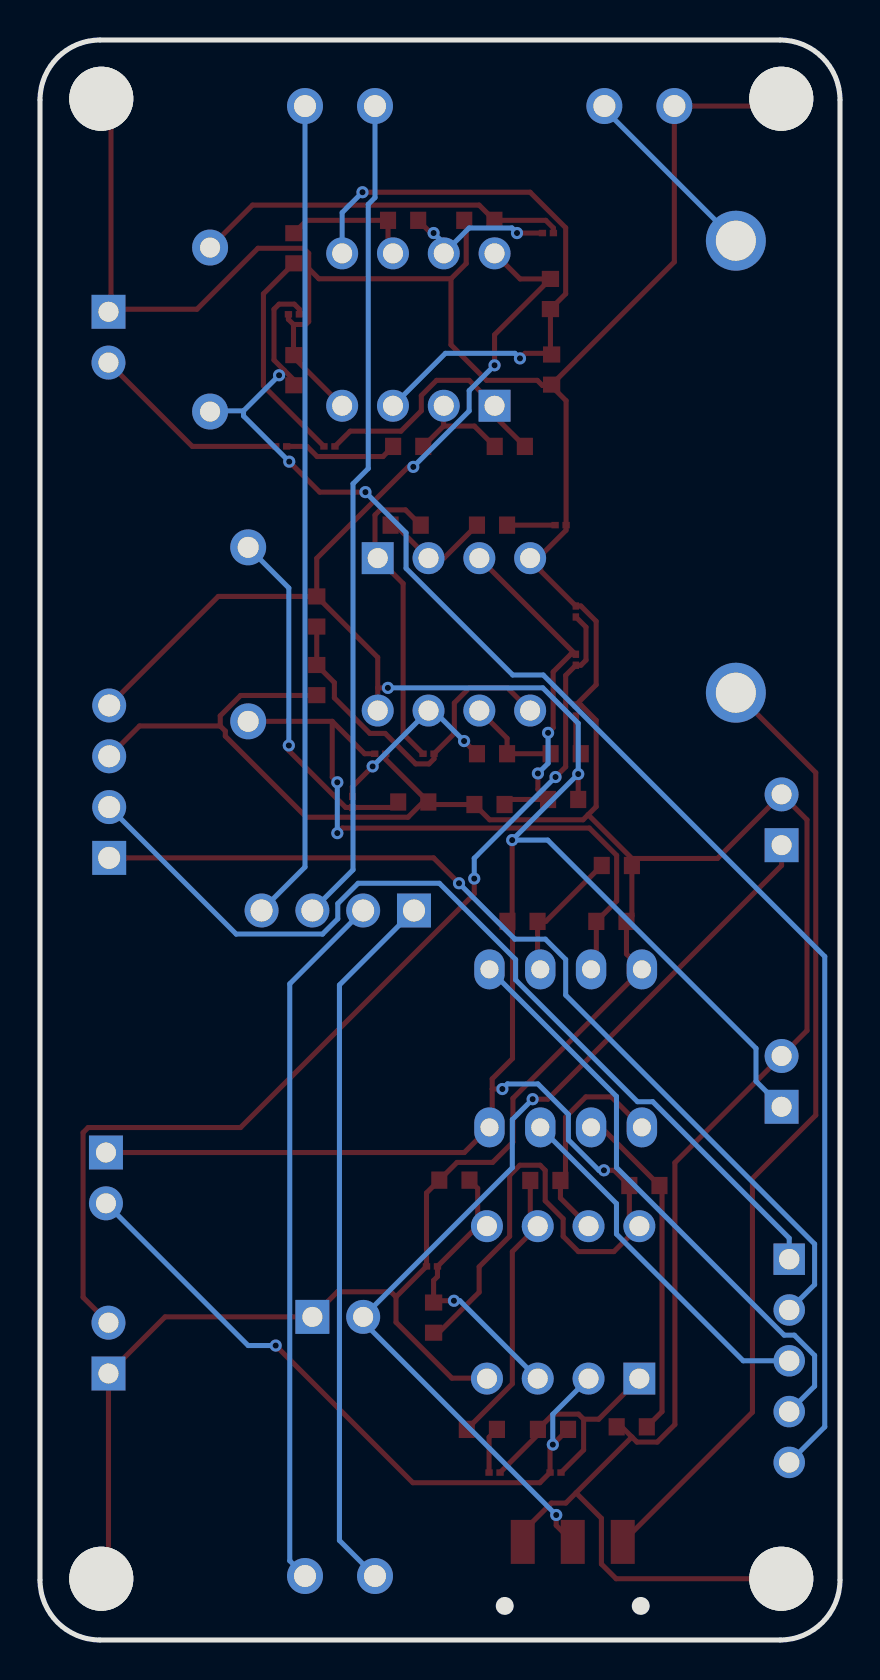
[diagram p5: board, bottom side, seen from below]

Outline 40 x 80 mm; copper layers: Top Layer, Bottom Layer. Coordinates in mm from the lower left corner of the outline.
Outline path: 0,77 0,3 arc(0.88,0.88) 3,0 37,0 arc(39.12,0.88) 40,3 40,77 arc(39.12,79.12) 37,80 3,80 arc(0.88,79.12) 0,77
Stack: Top Layer 0.035mm / Dielectric1 1.51mm FR4 er 4.5 / Bottom Layer 0.035mm

## Design rules (mm)
template: JLCPCB Capability(Two Layers Board)
spacing copperThickness1oz (default): track to track 0.102, other pairs 0.152 to 0.3
spacing copperThickness2oz: track to track 0.203, other pairs 0.152 to 0.3
track width copperThickness1oz (default): min 0.127, default 0.254, max 2.54
track width copperThickness2oz: min 0.203, default 0.254, max 2.54
differential pair differentialPair (default): width min 0.127, default 0.254, max 2.54; gap min 0.152, default 0.152
via viaSize (default): diameter min 0.5, default 0.61, max 10; hole min 0.3, default 0.305, max 6.3

## Placement (name value [footprint] x y rotation side)
C11  1uF  [C0201]  27.94 59.68 0 top
C12  1uF  [C0201]  25.53 59.68 180 top
C13  100nF  [C0201]  14.6 70.35 0 top
C14  100nF  [C0201]  27.31 66.28 0 top
C15  68nF  [C0201]  13.21 51.42 90 top
C16  100nF  [C0201]  13.21 49.01 270 top
C17  100nF  [C0201]  13.97 55.74 180 top
C18  22nF  [C0201]  22.99 44.31 180 top
C21  100nF  [C0201]  20.57 44.31 180 top
C22  100nF  [C0201]  13.21 46.47 90 top
C23  100nF  [C0201]  24.38 41.9 90 top
C24  1uF  [C0201]  20.4 18.68 0 top
C25  100pF  [C0201]  14.22 8.37 180 top
C26  100nF  [C0201]  17.27 8.37 0 top
D2  1N5817  [DO-41_BD2.4-L4.7-P8.70-D0.8-RD]  29.59 50.28 90 top
FH2  FH1-200CK-G  [FUSE-TH_L24.8-W9.8-P22.60]  5.21 58.66 270 top
H14  PM254V-11-04-H85  [HDR-TH_4P-P2.54-V-F]  25.11 36.48 0 top
H15  PM254V-11-04-H85  [HDR-TH_4P-P2.54-V-F]  36.54 42.92 90 top
P3  2.54-1*2P母  [HDR-TH_2P-P2.54-V-F]  2.92 41.01 90 top
P4  2.54-1*2P母  [HDR-TH_2P-P2.54-V-F]  25.11 16.16 180 top
P5  2.54-1*2P母  [HDR-TH_2P-P2.54-V-F]  2.92 27.93 90 top
P6  2.54-1*2P母  [HDR-TH_2P-P2.54-V-F]  36.58 65.14 270 top
P7  2.54-1*2P母  [HDR-TH_2P-P2.54-V-F]  36.58 14.59 90 top
P8  2.54-1*2P母  [HDR-TH_2P-P2.54-V-F]  36.7 23.1 270 top
R24  1K  [R0603]  21.59 59.68 180 top
R25  27K  [R0603]  16.51 59.68 180 top
R26  27K  [R0603]  21.84 70.98 180 top
R27  1K  [R0603]  27.31 69.59 90 top
R28  10K  [R0603]  18.03 70.98 180 top
R29  100K  [R0603]  27.31 63.49 270 top
R30  10K  [R0603]  14.48 67.3 90 top
R31  10K  [R0603]  14.42 63.52 90 top
R32  24K  [R0603]  21.72 55.74 0 top
R34  1K  [R0603]  17.4 55.74 0 top
R35  10K  [R0603]  11.43 35.93 0 top
R40  100K  [R0603]  14.35 10.53 180 top
R41  100K  [R0603]  14.73 22.98 0 top
R47  10K  [R0603]  13.84 42.03 180 top
R48  10K  [R0603]  17.53 41.77 180 top
R49  10K  [R0603]  26.16 51.42 90 top
R50  10K  [R0603]  26.16 48 90 top
R51  24K  [R0603]  17.4 44.31 180 top
R52  1K  [R0603]  13.72 44.31 0 top
R53  10K  [R0603]  21.34 41.9 0 top
R54  100K  [R0603]  15.88 35.93 0 top
R55  10K  [R0603]  11.16 38.72 0 top
R56  10K  [R0603]  20.32 16.12 270 top
R57  10K  [R0603]  19.28 22.99 180 top
R58  100  [R0603]  17.91 10.53 180 top
R59  27K  [R0603]  10.41 10.66 180 top
R60  5.1K  [R0603]  9.78 22.72 0 top
SCREW1  -  [Screw-Hole-M3]  3 77 0 top
SCREW2  -  [Screw-Hole-M3]  37 77 0 top
SCREW3  -  [Screw-Hole-M3]  3 3 0 top
SCREW4  -  [Screw-Hole-M3]  37 3 0 top
SW5  MST-12D18G4 SPDT Slide Switch  [SW-SMD_MST-12D18G4-SPDT-SLIDE-SWITCH]  13.36 4.9 0 top
U6  1N914  [DO-35_BD2.0-L4.2-P8.20-D0.5-R-RD]  31.5 65.52 90 top
U7  DB301V-3.5-2P-GN-S  [CONN-TH_DB301V-3.5-2P-GN]  25 3.2 0 top
U8  DB301V-3.5-2P-GN-S  [CONN-TH_DB301V-3.5-2P-GN]  25 76.7 180 top
U9  DB301V-3.5-2P-GN-S  [CONN-TH_DB301V-3.5-2P-GN]  10.03 76.7 180 top
U15  MCP6022-E/P  [PDIP-8_L9.6-W6.4-P2.54-LS7.9-BL]  21.08 65.52 0 top
U16  MCP6022-E/P  [PDIP-8_L9.6-W6.4-P2.54-LS7.9-BL]  19.3 50.28 180 top
U17  MCP6022-E/P  [PDIP-8_L9.6-W6.4-P2.54-LS7.9-BL]  13.84 16.88 0 top
U18  MCP6542-E/P  [PDIP-8_L9.3-W6.4-P2.54-LS7.9-BL-1]  13.72 29.58 180 top
U21  PM2.54-1X5PM-H85  [HDR-TH_5P-P2.54-V-F-3]  2.54 13.96 270 top

## Footprints (pads in the part's own frame, mm; a bottom-side part is the same pattern mirrored in y, then rotated)
C0201
  rect 0.368x0.324 smd: 1(-0.275,0) 2(0.275,0)
CONN-TH_DB301V-3.5-2P-GN
  round 1.8 hole 1.1: 1(-1.75,0) 2(1.75,0)
DO-35_BD2.0-L4.2-P8.20-D0.5-R-RD
  round 1.8 hole 1: 1(4.1,0) 2(-4.1,0)
DO-41_BD2.4-L4.7-P8.70-D0.8-RD
  round 1.8 hole 1.05: 1(-4.35,0) 2(4.35,0)
FUSE-TH_L24.8-W9.8-P22.60
  round 3 hole 2: 1(-11.3,0) 2(11.3,0)
HDR-TH_2P-P2.54-V-F
  rect 1.7x1.7 hole 1: 1(-1.27,0)
  round 1.7 hole 1: 2(1.27,0)
HDR-TH_4P-P2.54-V-F
  rect 1.7x1.7 hole 1.1: 1(-3.81,0)
  round 1.7 hole 1.1: 2(-1.27,0) 3(1.27,0) 4(3.81,0)
HDR-TH_5P-P2.54-V-F-3
  rect 1.575x1.575 hole 1.02: 1(-5.08,0)
  round 1.575 hole 1.02: 2(-2.54,0) 3(0,0) 4(2.54,0) 5(5.08,0)
PDIP-8_L9.3-W6.4-P2.54-LS7.9-BL-1
  oval 1.524x2 hole 0.9: 1(-3.81,-3.95) 2(-1.27,-3.95) 3(1.27,-3.95) 4(3.81,-3.95) 5(3.81,3.95) 6(1.27,3.95) 7(-1.27,3.95) 8(-3.81,3.95)
PDIP-8_L9.6-W6.4-P2.54-LS7.9-BL
  rect 1.6x1.6 hole 1: 1(-3.81,-3.81)
  round 1.6 hole 1: 2(-1.27,-3.81) 3(1.27,-3.81) 4(3.81,-3.81) 5(3.81,3.81) 6(1.27,3.81) 7(-1.27,3.81) 8(-3.81,3.81)
R0603
  rect 0.806x0.864 smd: 1(-0.753,0) 2(0.753,0)
Screw-Hole-M3
  round 3.2 hole 3.2: 1(-0.064,0.064)
SW-SMD_MST-12D18G4-SPDT-SLIDE-SWITCH
  rect 1.2x2.2 smd: 1(-2.5,0) 2(0,0) 3(2.5,0)

## Nets
As in the schematic.

## Via types
v1: diameter 0.61, hole 0.305, Top Layer to Bottom Layer, 29 vias

## Routing (per net, layer and track width the routed paths; a pad name or vN(x,y) marks a point on that pad's centre or on a via; arc(x,y) is an arc through that point)
3.3V: length 149.8
  Top Layer w0.254: 17.39,27.55 17.39,28.06 16.37,29.07 16.37,35.68 R54.2 16.39,36.17 v1(16.39,40) ; 17.39,27.55 v1(16.88,27.55) ; 17.39,27.55 17.39,25.77 U18.8 18.78,24.37 P8.1 ; R49.2 26.16,54.08 21.59,58.66 v1(21.34,58.66) ; R49.2 23.11,49.13 23.11,47.61 ; R49.2 31.09,52.18 H15.4 ; v1(11.8,23.48) 11.29,23.48 R60.2 10.53,21.19 U17.8 11.3,19.42 13.08,19.42 13.84,20.18 13.84,21.06 14.74,21.96 14.74,23.48 14.99,23.74 16.01,23.74 16.52,23.23 16.52,20.18 18.04,18.66 18.04,17.39 20.07,15.37 R56.2 ; v1(13.09,43.3) R47.2 ; U15.8 15.99,68.05 R30.2 17.27,65.26 v1(17.27,63.74) ; 23.11,47.61 U16.8 ; 23.11,47.61 v1(22.61,47.61)
  Bottom Layer w0.254: v1(16.88,27.55) 16.63,27.8 15.1,27.8 13.58,26.28 13.58,25.01 12.06,23.48 v1(11.8,23.48) ; P5.1 4.2,27.94 4.2,29.58 14.61,40 v1(16.39,40) v1(13.09,43.3) 13.09,45.84 14.86,47.61 v1(22.61,47.61) ; v1(21.34,58.66) 18.54,61.45 18.54,62.47 v1(17.27,63.74)
GND: length 269.3
  Top Layer w0.254: 12.59,41.27 12.19,41.67 12.19,45.98 12.95,46.75 C22.2 12.19,47.76 12.19,50.94 12.95,51.7 C15.2 14.97,53.46 14.97,54.22 ; 12.59,41.27 10.41,39.08 ; 12.59,41.27 12.85,41.01 17.52,41.01 R48.1 20.46,41.77 R53.1 20.84,42.15 ; 22.2,17.16 22.45,17.41 25.13,17.41 P4.1 33.75,16.16 P7.1 36.58,3.42 SCREW4.1 ; 22.2,17.16 22.2,15.89 19.41,13.09 17.67,13.09 U17.4 ; 22.2,17.16 20.68,18.68 20.68,22.35 R57.1 19.15,23.88 17.37,23.88 16.35,24.89 16.35,27.08 U18.4 10.68,34.3 R35.1 10.41,36.2 10.41,39.08 ; R50.1 26.18,47.23 29.97,47.23 30.99,46.21 30.99,45.7 ; 19.45,68.06 18.69,68.82 18.69,70.89 R28.1 ; 19.45,68.06 19.45,64.76 17.67,62.98 15.13,62.98 14.88,62.73 14.46,62.73 ; 19.45,68.06 26.06,68.06 26.56,68.57 ; 10.41,10.15 10.91,10.66 R59.1 ; 10.41,10.15 10.15,9.9 9.14,9.9 8.25,10.78 8.25,23.87 P5.2 1.65,30.47 1.65,41.01 P3.2 6.12,39.08 10.41,39.08 ; 10.41,10.15 13.2,7.36 ; 26.56,68.57 26.56,69.33 26.82,69.59 29.1,69.59 32.15,66.54 36.45,66.54 ; 26.56,68.57 26.56,65.92 26.71,65.78 27.33,65.78 ; SCREW1.1 3.3,76.7 U9.2 8.28,68.9 R31.1 14.46,62.73 ; 30.99,45.7 35.02,45.7 H15.3 ; 30.99,45.7 30.73,45.45 30.73,45.19 26.68,41.14 21.6,41.14 20.84,41.9 20.84,42.15 ; 14.46,62.73 13.7,61.97 C17.2 13.7,55.49 14.97,54.22 ; U15.4 27.31,64.12 R29.1 27.33,64.26 27.33,65.78 ; 27.33,65.78 27.58,66.03 C14.2 ; 20.84,42.15 22.71,44.03 C18.2 ; 36.45,66.54 36.45,76.58 SCREW2.1 ; 36.45,66.54 P6.1 ; 14.97,54.22 15.37,54.22 U16.4 ; SW5.3 15.86,5.41 14.43,6.85 13.71,6.85 13.2,7.36 ; 13.2,7.36 11.93,6.09 11.93,3.8 11.19,3.06 SCREW3.1
VBATT_IN: length 9.5
  Bottom Layer w0.254: U9.1 11.78,76.54 FH2.1
VBATT_OUT: length 48.3
  Top Layer w0.254: v1(14.19,6.25) 14.19,5.73 SW5.2 ; P3.1 2.92,38.72 14.6,27.04 v1(15.37,27.04)
  Bottom Layer w0.254: v1(15.37,27.04) 16.38,26.03 16.38,23.61 P4.2 23.84,15.9 v1(14.19,6.25)
AGE_OUT: length 29.7
  Bottom Layer w0.254: U21.4 1.27,12.69 1.27,14.23 2.29,15.24 2.79,15.24 11.18,23.62 11.18,27.18 U18.1
HVCC_IR: length 14.5
  Top Layer w0.254: 18.12,20.69 18.12,22.58 R57.2 ; 18.12,20.69 C24.1 20.13,18.17 20.32,17.98 20.32,16.96 ; 18.12,20.69 U17.5 ; 20.32,16.96 v1(19.3,16.96) ; 20.32,16.96 R56.1
  Bottom Layer w0.254: U17.3 19,16.96 v1(19.3,16.96)
HVCC_ULT: length 30.2
  Top Layer w0.254: 14.48,64.33 15.75,64.33 v1(16,64.08) ; 14.48,64.33 R30.1 13.72,67.31 13.72,70.61 15.49,72.39 v1(23.88,72.39) ; 14.48,64.33 R31.2
  Bottom Layer w0.254: U15.3 19.73,64.33 16.26,64.33 v1(16,64.08) ; v1(23.88,72.39) 24.89,71.37 U15.5
IR_OUT: length 18.2
  Bottom Layer w0.254: U18.7 11.18,21.82 11.18,20.3 4.84,13.96 U21.3
ML+: length 41.1
  Bottom Layer w0.254: U8.1 26.75,38.65 H14.4
ML-: length 41.5
  Bottom Layer w0.254: H14.3 24.35,38.51 24.35,57.81 23.59,58.57 23.59,71.78 23.25,72.12 U8.2
MR+: length 35.1
  Bottom Layer w0.254: U7.2 27.51,3.96 27.51,32.81 H14.2
MR-: length 35.6
  Bottom Layer w0.254: H14.1 25.03,32.75 25.03,4.98 U7.1
SCL: length 47.1
  Bottom Layer w0.254: U21.1 2.54,20.09 9.36,26.91 10.12,26.91 16.22,33.01 16.22,34.03 20.03,37.84 24.09,37.84 25.11,36.82 25.11,36.06 25.87,35.3 30.19,35.3 H15.2
SDA: length 48.1
  Top Layer w0.254: v1(19.05,37.84) 20.32,39.11 H15.1
  Bottom Layer w0.254: v1(19.05,37.84) 16.26,35.04 14.73,35.04 13.72,34.03 13.72,32.25 1.27,19.8 1.27,17.77 U21.2
ULT_OUT: length 78.1
  Top Layer w0.254: 27.79,63.49 v1(28.05,63.24) ; 27.79,63.49 27.31,63 R29.2 ; 27.79,63.49 28.3,64 28.3,66.54 28.05,66.79 27.28,66.79 27.03,66.54 C14.1 ; v1(23.73,57.39) 26.01,57.39 v1(27.54,58.92)
  Bottom Layer w0.254: v1(27.54,58.92) 29.82,61.2 29.82,61.46 ; 29.82,61.46 31.46,61.46 U6.2 ; 29.82,61.46 v1(28.05,63.24) ; U21.5 0.76,10.66 0.76,34.17 14.84,48.25 16.36,48.25 21.7,53.58 21.7,55.36 v1(23.73,57.39)
$1N2978: length 10.1
  Top Layer w0.254: C11.2 32.38,59.68 P6.2
$1N2979: length 5.7
  Top Layer w0.254: R24.1 22.85,59.17 26.14,59.17 26.65,59.68 C11.1
$1N2980: length 5.4
  Top Layer w0.254: 19.82,60.7 18.28,60.7 R25.1 ; 19.82,60.7 19.82,61.7 U15.2 ; 19.82,60.7 R24.2
$1N2981: length 13
  Top Layer w0.254: R25.2 17.27,61.2 U15.1 18.54,62.98 20.17,62.98 20.93,62.22 20.93,61.46 21.95,60.44 24.49,60.44 C12.2
$1N2983: length 11
  Top Layer w0.254: R27.1 28.83,67.31 28.83,62.71 C12.1
$1N2984: length 6.7
  Top Layer w0.254: R27.2 26.66,70.98 R26.1 22.6,69.58 U15.6
$1N2986: length 7.8
  Top Layer w0.254: C13.2 v1(16.15,70.35) ; v1(20.32,70.35) 20.46,70.35 R26.2
  Bottom Layer w0.254: v1(16.15,70.35) 16.4,70.6 18.54,70.6 U15.7 19.81,69.84 v1(20.32,70.35)
$1N2990: length 18.8
  Top Layer w0.254: U6.1 29.37,71.75 18.04,71.75 R28.2 14.71,70.98 14.33,70.6 C13.1
$1N2997: length 51.1
  Top Layer w0.254: v1(18.29,38.07) 18.29,37.31 29.97,25.62 37.59,25.62 37.85,25.37 37.85,17.13 P7.2 ; v1(14.22,43.15) 13.72,43.66 13.72,48.23 C16.2 12.95,48.74 12.7,48.99 12.7,50.64 C15.1
  Bottom Layer w0.254: v1(18.29,38.07) 18.29,39.09 v1(14.22,43.15)
$1N2999: length 17.5
  Top Layer w0.254: R48.2 16.52,42.03 R47.1 15.1,42.53 v1(15.1,43.33) ; v1(14.6,45.36) 14.34,45.61 14.34,48.41 13.46,49.29 13.23,49.29 ; 13.23,49.29 C16.1 ; 13.23,49.29 U16.3
  Bottom Layer w0.254: v1(15.1,43.33) 14.6,43.83 v1(14.6,45.36)
$1N3003: length 5.7
  Top Layer w0.254: R34.2 19.8,54.09 U16.2 22.22,55.74 R32.2
$1N3004: length 15.6
  Top Layer w0.254: R32.1 21.73,56.5 23,56.5 23.25,56.25 23.25,54.23 U16.1 21.84,52.82 21.84,45.31 C21.1
$1N3031: length 34.8
  Top Layer w0.254: R40.2 14.5,9.63 C25.1 15.01,7.86 21.36,7.86 v1(28.21,14.72)
  Bottom Layer w0.254: v1(14.36,9.77) 14.36,11.28 U17.2 ; v1(28.21,14.72) 29.59,14.72 P8.2
$1N3032: length 12.4
  Top Layer w0.254: C25.2 12.82,9.5 12.82,11.04 ; 12.82,11.04 13.07,11.29 14.34,11.29 R40.1 15.1,10.27 C26.1 ; 12.82,11.04 12.06,11.04 U17.1
$1N3034: length 11
  Top Layer w0.254: U18.5 11.43,27.16 12.71,27.16 13.72,26.14 13.72,23.23 R41.1 13.98,22.1 U17.7
$1N4237: length 2.4
  Top Layer w0.254: C17.1 R34.1
$1N8727: length 33.6
  Top Layer w0.254: 25.39,45.93 D2.1 ; 25.39,45.93 23.77,44.31 C18.1 ; 25.39,45.93 25.39,43.14 v1(25.13,42.88) ; U18.3 12.18,33.79 R35.2 11.17,36.95 11.17,39.23 12.53,40.6 24.88,40.6 v1(25.13,40.34)
  Bottom Layer w0.254: v1(25.13,42.88) v1(25.13,40.34)
$1N9006: length 18.2
  Top Layer w0.254: R49.1 R50.2 25.28,47.87 25.28,47.11 23.5,45.33 22.74,45.33 21.22,43.81 20.55,43.81 20.3,44.06 C21.2 19.28,45.33 19.28,46.85 18.52,47.61 16.64,47.61 U16.5
$1N9117: length 9.2
  Top Layer w0.254: v1(18.8,44.95) R51.1 ; v1(23.37,43.68) 24.38,42.66 C23.2
  Bottom Layer w0.254: v1(18.8,44.95) 20.32,46.47 U16.7 v1(23.37,43.68)
$1N9118: length 4.9
  Top Layer w0.254: U16.6 16.65,45.08 R51.2 R52.2
$1N9122: length 2
  Top Layer w0.254: R52.1 13.21,44.56 C22.1
$1N9252: length 17.8
  Top Layer w0.254: R53.2 22.36,41.63 C23.1 24.71,41.63 27.56,44.47 v1(27.56,44.73)
  Bottom Layer w0.254: v1(27.56,44.73) 27.56,52.6 D2.2
$1N9334: length 6.8
  Top Layer w0.254: R55.2 14.71,35.93 R54.1 15.12,33.67 U18.2
$1N11674: length 2.3
  Top Layer w0.254: R58.2 17.55,10.14 C26.2
$1N11682: length 14.1
  Top Layer w0.254: R58.1 16.38,12.81 16.38,19.42 U17.6 15.49,21.06 R41.2
$1N11954: length 17.1
  Top Layer w0.254: R59.2 8.9,11.42 8.9,22.6 R60.1 11.93,25.63 U18.6
$1N13885: length 48.1
  Top Layer w0.254: FH2.2 1.21,43.37 1.21,26.24 4.38,23.07 4.38,11.39 SW5.1

## Text on the board
Top Silkscreen Layer: VBATT / _OUT | 3.3V / _IN | GND | AGE | IR | ULT | SDA | -BATT+ | -ML+ | -MR+ | 3.3V | MAG | SCL | + | - | ON | OFF | MR- | VBATT | MR+ | ML- | ML+
